# Altium project DisplayBrd.PrjPCB
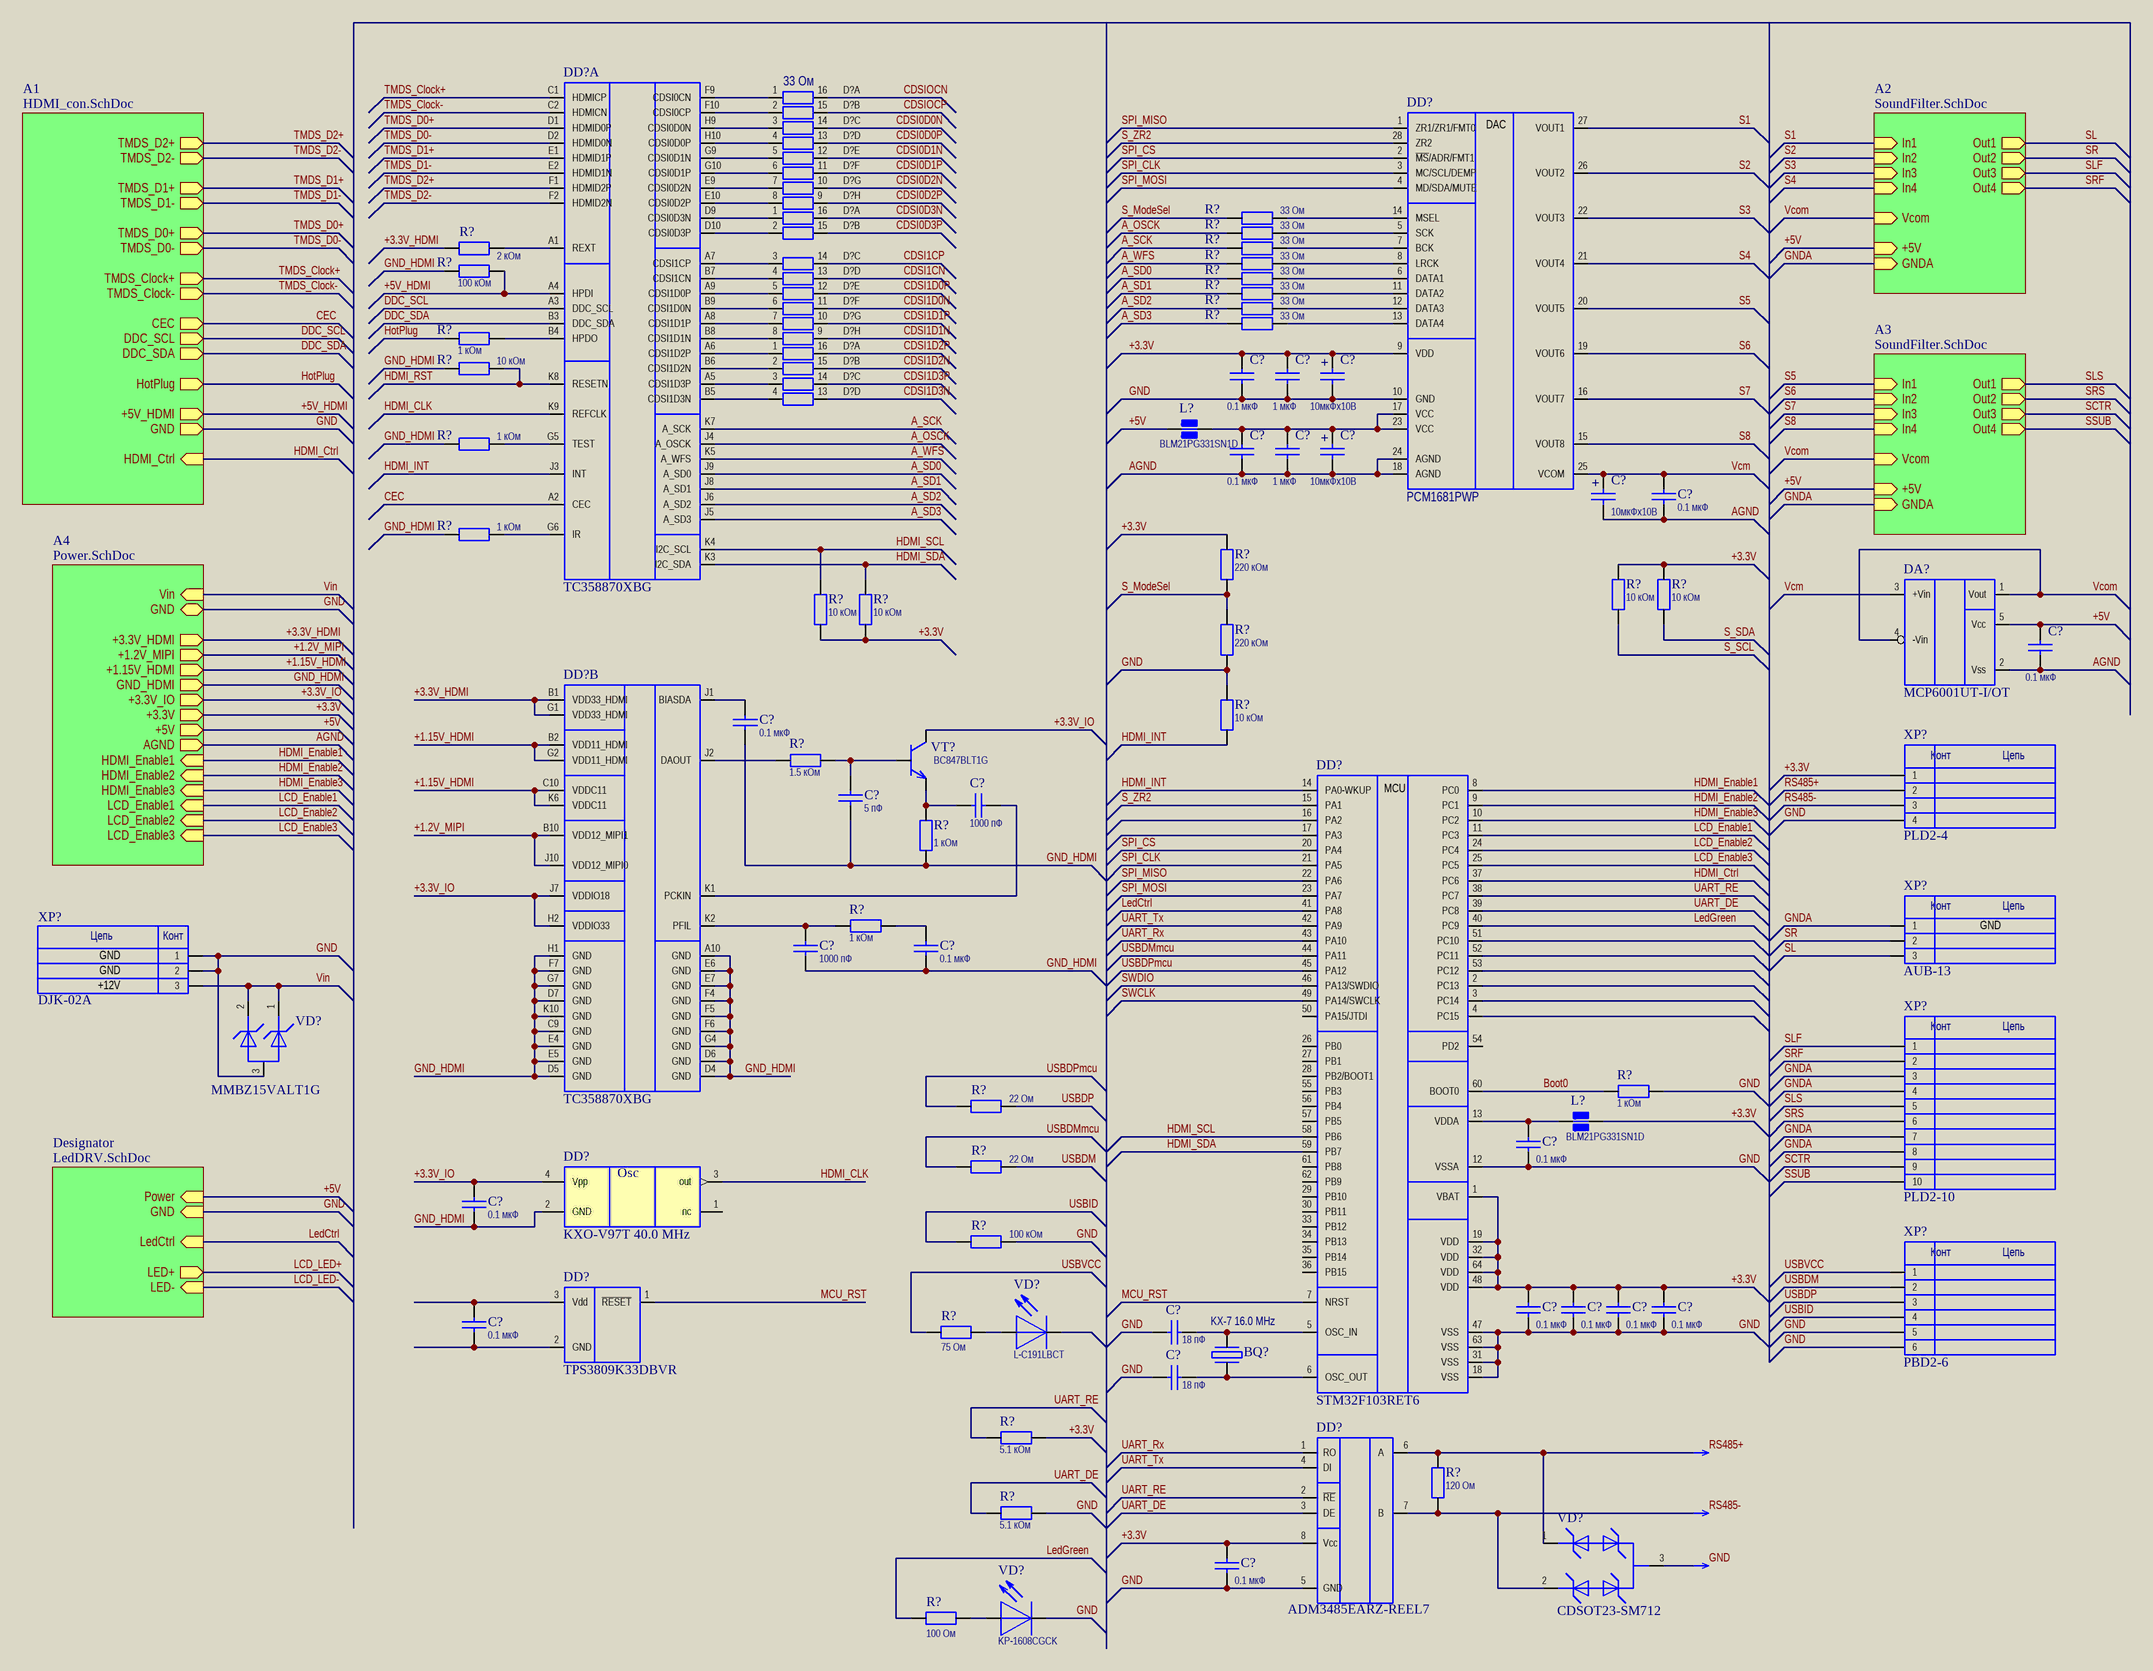
[diagram p0: Top.SchDoc]
6 sheets, 302 parts. Net scope: hierarchical (ports join the sheet entries above them; power ports are global).
Sheets:
  Top.SchDoc
    A2 = SoundFilter.SchDoc
    A3 = SoundFilter.SchDoc
    A1 = HDMI_con.SchDoc
    A4 = Power.SchDoc
    Designator = LedDRV.SchDoc
  LCD_Connector.SchDoc

## Sheet Top.SchDoc
size 437 x 311 mm

### Parts
(Parts that share a designator on the sheet are numbered #1, #2 ... from top to bottom, then left to right.)
BQ?  KX-7 16.0 MHz  [KX-7]
C?#1  value 0.1 мкФ  [Chip0603]  (hidden comment: C)
C?#2  value 1 мкФ  [Chip0603]  (hidden comment: C)
C?#3  value 10мкФx10В  [ChipA]  (hidden comment: CP)
C?#4  value 0.1 мкФ  [Chip0603]  (hidden comment: C)
C?#5  value 1 мкФ  [Chip0603]  (hidden comment: C)
C?#6  value 10мкФx10В  [ChipA]  (hidden comment: CP)
C?#7  value 10мкФx10В  [ChipA]  (hidden comment: CP)
C?#8  value 0.1 мкФ  [Chip0603]  (hidden comment: C)
C?#9  value 0.1 мкФ  [Chip0603]  (hidden comment: C)
C?#10  value 0.1 мкФ  [Chip0603]  (hidden comment: C)
C?#11  value 5 пФ  [Chip0603]  (hidden comment: C)
C?#12  value 1000 пФ  [Chip0603]  (hidden comment: C)
C?#13  value 0.1 мкФ  [Chip0603]  (hidden comment: C)
C?#14  value 1000 пФ  [Chip0603]  (hidden comment: C)
C?#15  value 0.1 мкФ  [Chip0603]  (hidden comment: C)
C?#16  value 0.1 мкФ  [Chip0603]  (hidden comment: C)
C?#17  value 0.1 мкФ  [Chip0603]  (hidden comment: C)
C?#18  value 0.1 мкФ  [Chip0603]  (hidden comment: C)
C?#19  value 0.1 мкФ  [Chip0603]  (hidden comment: C)
C?#20  value 0.1 мкФ  [Chip0603]  (hidden comment: C)
C?#21  value 0.1 мкФ  [Chip0603]  (hidden comment: C)
C?#22  value 18 пФ  [Chip0603]  (hidden comment: C)
C?#23  value 18 пФ  [Chip0603]  (hidden comment: C)
C?#24  value 0.1 мкФ  [Chip0603]  (hidden comment: C)
D?#1  value 33 Ом  [YC248]  (hidden comment: YC248-JR-0733RL)  (part A of 8)
D?#2  YC248-JR-0733RL  [YC248]  (value not drawn)  (part B of 8)
D?#3  YC248-JR-0733RL  [YC248]  (value not drawn)  (part C of 8)
D?#4  YC248-JR-0733RL  [YC248]  (value not drawn)  (part D of 8)
D?#5  YC248-JR-0733RL  [YC248]  (value not drawn)  (part E of 8)
D?#6  YC248-JR-0733RL  [YC248]  (value not drawn)  (part F of 8)
D?#7  YC248-JR-0733RL  [YC248]  (value not drawn)  (part G of 8)
D?#8  YC248-JR-0733RL  [YC248]  (value not drawn)  (part H of 8)
D?#9  YC248-JR-0733RL  [YC248]  (value not drawn)  (part A of 8)
D?#10  YC248-JR-0733RL  [YC248]  (value not drawn)  (part B of 8)
D?#11  YC248-JR-0733RL  [YC248]  (value not drawn)  (part C of 8)
D?#12  YC248-JR-0733RL  [YC248]  (value not drawn)  (part D of 8)
D?#13  YC248-JR-0733RL  [YC248]  (value not drawn)  (part E of 8)
D?#14  YC248-JR-0733RL  [YC248]  (value not drawn)  (part F of 8)
D?#15  YC248-JR-0733RL  [YC248]  (value not drawn)  (part G of 8)
D?#16  YC248-JR-0733RL  [YC248]  (value not drawn)  (part H of 8)
D?#17  YC248-JR-0733RL  [YC248]  (value not drawn)  (part A of 8)
D?#18  YC248-JR-0733RL  [YC248]  (value not drawn)  (part B of 8)
D?#19  YC248-JR-0733RL  [YC248]  (value not drawn)  (part C of 8)
D?#20  YC248-JR-0733RL  [YC248]  (value not drawn)  (part D of 8)
DA?#1  MCP6001UT-I/OT  [SOT23-5]
DD?#1  PCM1681PWP  [HTSSOP-28]
DD?#2  TC358870XBG  [BGA80C65P10X10_700X700X100]  (part A of 2)
DD?#3  STM32F103RET6  [LQFP64_N]
DD?#4  TC358870XBG  [BGA80C65P10X10_700X700X100]  (part B of 2)
DD?#5  KXO-V97T 40.0 MHz  [KXO-V97T]
DD?#6  TPS3809K33DBVR  [SOT23]
DD?#7  ADM3485EARZ-REEL7  [SO8_s]
L?#1  Name: BLM21PG331SN1D  [Chip0805]  (hidden comment: Bead)
L?#2  Name: BLM21PG331SN1D  [Chip0805]  (hidden comment: Bead)
R?#1  33 Ом  [Res0603]
R?#2  33 Ом  [Res0603]
R?#3  2 кОм  [Res0603]
R?#4  33 Ом  [Res0603]
R?#5  33 Ом  [Res0603]
R?#6  100 кОм  [Res0603]
R?#7  33 Ом  [Res0603]
R?#8  33 Ом  [Res0603]
R?#9  33 Ом  [Res0603]
R?#10  33 Ом  [Res0603]
R?#11  1 кОм  [Res0603]
R?#12  10 кОм  [Res0603]
R?#13  1 кОм  [Res0603]
R?#14  1 кОм  [Res0603]
R?#15  220 кОм  [Res0603]
R?#16  10 кОм  [Res0603]
R?#17  10 кОм  [Res0603]
R?#18  10 кОм  [Res0603]
R?#19  10 кОм  [Res0603]
R?#20  220 кОм  [Res0603]
R?#21  10 кОм  [Res0603]
R?#22  1.5 кОм  [Res0603]
R?#23  1 кОм  [Res0603]
R?#24  1 кОм  [Res0603]
R?#25  1 кОм  [Res0603]
R?#26  22 Ом  [Res0603]
R?#27  22 Ом  [Res0603]
R?#28  100 кОм  [Res0603]
R?#29  75 Ом  [Res0603]
R?#30  5.1 кОм  [Res0603]
R?#31  120 Ом  [Res0603]
R?#32  5.1 кОм  [Res0603]
R?#33  100 Ом  [Res0603]
VD?#1  MMBZ15VALT1G  [SOT23]
VD?#2  L-C191LBCT  [LED_ltst_blue]
VD?#3  CDSOT23-SM712  [SOT23]
VD?#4  KP-1608CGCK  [LED_ltst_green]
VT?#1  Name: BC847BLT1G  [SOT23]  (hidden comment: NPN)
XP?#1  AUB-13  [AUB-13]
XP?#2  DJK-02A  [DJK-02A]
XP?#3  CON_4  [PLD2-4]  (value not drawn)
XP?#4  PLD2-10  [PLD2-10]
XP?#5  Name: PBD2-6  [USB-MINI]  (hidden comment: CON_6)

### Sub-sheets
A1 = HDMI_con.SchDoc: TMDS_D2+ (out), TMDS_D2- (out), TMDS_D1+ (out), TMDS_D1- (out), TMDS_D0+ (out), TMDS_D0- (out), TMDS_Clock+ (out), TMDS_Clock- (out), CEC (out), DDC_SCL (out), DDC_SDA (out), HotPlug (out), +5V_HDMI (out), GND (out), HDMI_Ctrl (in)
A2 = SoundFilter.SchDoc: In1 (in), In2 (in), In3 (in), In4 (in), Vcom (in), +5V (in), GNDA (in), Out1 (out), Out2 (out), Out3 (out), Out4 (out)
A3 = SoundFilter.SchDoc: In1 (in), In2 (in), In3 (in), In4 (in), Vcom (in), +5V (in), GNDA (in), Out1 (out), Out2 (out), Out3 (out), Out4 (out)
A4 = Power.SchDoc: Vin (in), GND (bidir), +3.3V_HDMI (out), +1.2V_MIPI (out), +1.15V_HDMI (out), GND_HDMI (out), +3.3V_IO (out), +3.3V (out), +5V (out), HDMI_Enable1 (in), HDMI_Enable2 (in), HDMI_Enable3 (in), LCD_Enable1 (in), LCD_Enable2 (in), LCD_Enable3 (in), AGND (out)
Designator = LedDRV.SchDoc: Power (in), GND (in), LedCtrl (in), LED+ (out), LED- (in)

### Nets
+3.3V: C?#1.1 C?#2.1 C?#3.1 C?#17.1 C?#18.1 C?#19.1 C?#20.1 C?#24.1 DD?#1.9(VDD) DD?#3.1(VBAT) DD?#3.19(VDD) DD?#3.32(VDD) DD?#3.48(VDD) DD?#3.64(VDD) DD?#7.8(Vcc) L?#2.2 R?#15.2 R?#16.2 R?#17.2 R?#18.1 R?#19.1 R?#30.2 XP?#3.1 ; sheet A4/+3.3V
+5V: C?#9.1 DA?#1.5(Vcc) L?#1.1 ; sheet A2/+5V, sheet A3/+5V, sheet A4/+5V, sheet Designator/Power
GND: BQ?.2 BQ?.4 C?#1.2 C?#2.2 C?#3.2 C?#15.2 C?#17.2 C?#18.2 C?#19.2 C?#20.2 C?#22.1 C?#23.1 C?#24.2 DD?#1.10(GND) DD?#3.12(VSSA) DD?#3.18(VSS) DD?#3.31(VSS) DD?#3.47(VSS) DD?#3.63(VSS) DD?#7.5(GND) R?#20.1 R?#21.1 R?#25.1 R?#28.2 R?#32.1 VD?#1.3 VD?#3.3 VD?#4.2 XP?#2.1 XP?#2.2 XP?#3.4 XP?#5.5 XP?#5.6 ; sheet A1/GND, sheet A4/GND, sheet Designator/GND
GNDA: XP?#1.1 XP?#4.3 XP?#4.4 XP?#4.7 XP?#4.8 ; sheet A2/GNDA, sheet A3/GNDA
+1.2V_MIPI: DD?#4.B10(VDD12_MIPI1) DD?#4.J10(VDD12_MIPI0) ; sheet A4/+1.2V_MIPI
+1.15V_HDMI: DD?#4.B2(VDD11_HDMI) DD?#4.C10(VDDC11) DD?#4.G2(VDD11_HDMI) DD?#4.K6(VDDC11) ; sheet A4/+1.15V_HDMI
+3.3V_HDMI: DD?#4.B1(VDD33_HDMI) DD?#4.G1(VDD33_HDMI) R?#3.2 ; sheet A4/+3.3V_HDMI
+3.3V_IO: C?#16.1 DD?#4.H2(VDDIO33) DD?#4.J7(VDDIO18) DD?#5.4(Vpp) VT?#1.3 ; sheet A4/+3.3V_IO
+5V_HDMI: DD?#2.A4(HPDI) R?#6.1 ; sheet A1/+5V_HDMI
A_OSCK: DD?#2.J4(A_OSCK) R?#2.1
A_SCK: DD?#2.K7(A_SCK) R?#4.1
A_SD0: DD?#2.J9(A_SD0) R?#7.1
A_SD1: DD?#2.J8(A_SD1) R?#8.1
A_SD2: DD?#2.J6(A_SD2) R?#9.1
A_SD3: DD?#2.J5(A_SD3) R?#10.1
A_WFS: DD?#2.K5(A_WFS) R?#5.1
AGND: C?#4.2 C?#5.2 C?#6.2 C?#7.2 C?#8.2 C?#9.2 DA?#1.2(Vss) DD?#1.18(AGND) DD?#1.24(AGND) ; sheet A4/AGND
Boot0: DD?#3.60(BOOT0) R?#25.2
CDSI0D0N: D?#3.14(B2)
CDSI0D0P: D?#4.13(B3)
CDSI0D1N: D?#5.12(B4)
CDSI0D1P: D?#6.11(B5)
CDSI0D2N: D?#7.10(B6)
CDSI0D2P: D?#8.9(B7)
CDSI0D3N: D?#9.16(B0)
CDSI0D3P: D?#10.15(B1)
CDSI1CN: D?#12.13(B3)
CDSI1CP: D?#11.14(B2)
CDSI1D0N: D?#14.11(B5)
CDSI1D0P: D?#13.12(B4)
CDSI1D1N: D?#16.9(B7)
CDSI1D1P: D?#15.10(B6)
CDSI1D2N: D?#18.15(B1)
CDSI1D2P: D?#17.16(B0)
CDSI1D3N: D?#20.13(B3)
CDSI1D3P: D?#19.14(B2)
CDSIOCN: D?#1.16(B0)
CDSIOCP: D?#2.15(B1)
CEC: DD?#2.A2(CEC) ; sheet A1/CEC
DDC_SCL: DD?#2.A3(DDC_SCL) ; sheet A1/DDC_SCL
DDC_SDA: DD?#2.B3(DDC_SDA) ; sheet A1/DDC_SDA
GND_HDMI: C?#10.2 C?#11.1 C?#13.2 C?#14.1 C?#16.2 DD?#4.A10(GND) DD?#4.C9(GND) DD?#4.D4(GND) DD?#4.D5(GND) DD?#4.D6(GND) DD?#4.D7(GND) DD?#4.E4(GND) DD?#4.E5(GND) DD?#4.E6(GND) DD?#4.E7(GND) DD?#4.F4(GND) DD?#4.F5(GND) DD?#4.F6(GND) DD?#4.F7(GND) DD?#4.G4(GND) DD?#4.G7(GND) DD?#4.H1(GND) DD?#4.K10(GND) DD?#5.2(GND) R?#6.2 R?#12.2 R?#13.2 R?#14.2 R?#23.1 ; sheet A4/GND_HDMI
HDMI_CLK: DD?#2.K9(REFCLK) DD?#5.3(out)
HDMI_Ctrl: DD?#3.37(PC6) ; sheet A1/HDMI_Ctrl
HDMI_Enable1: DD?#3.8(PC0) ; sheet A4/HDMI_Enable1
HDMI_Enable2: DD?#3.9(PC1) ; sheet A4/HDMI_Enable2
HDMI_Enable3: DD?#3.10(PC2) ; sheet A4/HDMI_Enable3
HDMI_INT: DD?#2.J3(INT) DD?#3.14(PA0-WKUP) R?#21.2
HDMI_RST: DD?#2.K8(RESETN) R?#12.1
HDMI_SCL: DD?#2.K4(I2C_SCL) DD?#3.58(PB6) R?#18.2
HDMI_SDA: DD?#2.K3(I2C_SDA) DD?#3.59(PB7) R?#19.2
HotPlug: R?#11.2 ; sheet A1/HotPlug
LCD_Enable1: DD?#3.11(PC3) ; sheet A4/LCD_Enable1
LCD_Enable2: DD?#3.24(PC4) ; sheet A4/LCD_Enable2
LCD_Enable3: DD?#3.25(PC5) ; sheet A4/LCD_Enable3
LedCtrl: DD?#3.41(PA8) ; sheet Designator/LedCtrl
LedGreen: DD?#3.40(PC9) R?#33.1
MCU_RST: DD?#3.7(NRST) DD?#6.1(~{RESET})
RS485+: DD?#7.6(A) R?#31.1 VD?#3.1 XP?#3.2
RS485-: DD?#7.7(B) R?#31.2 VD?#3.2 XP?#3.3
S1: DD?#1.27(VOUT1) ; sheet A2/In1  [project net In1]
S2: DD?#1.26(VOUT2) ; sheet A2/In2  [project net In2]
S3: DD?#1.22(VOUT3) ; sheet A2/In3  [project net In3]
S4: DD?#1.21(VOUT4) ; sheet A2/In4  [project net In4]
S5: DD?#1.20(VOUT5) ; sheet A3/In1  [project net In1]
S6: DD?#1.19(VOUT6) ; sheet A3/In2  [project net In2]
S7: DD?#1.16(VOUT7) ; sheet A3/In3  [project net In3]
S8: DD?#1.15(VOUT8) ; sheet A3/In4  [project net In4]
S_ModeSel: R?#1.1 R?#15.1 R?#20.2
S_SCL: R?#16.1
S_SDA: R?#17.1
S_ZR2: DD?#1.28(ZR2) DD?#3.15(PA1)
SCTR: XP?#4.9 ; sheet A3/Out3  [project net Out3]
SL: XP?#1.3 ; sheet A2/Out1  [project net Out1]
SLF: XP?#4.1 ; sheet A2/Out3  [project net Out3]
SLS: XP?#4.5 ; sheet A3/Out1  [project net Out1]
SPI_CLK: DD?#1.3(MC/SCL/DEMP) DD?#3.21(PA5)
SPI_CS: DD?#1.2(~{MS}/ADR/FMT1) DD?#3.20(PA4)
SPI_MISO: DD?#1.1(ZR1/ZR1/FMT0) DD?#3.22(PA6)
SPI_MOSI: DD?#1.4(MD/SDA/MUTE) DD?#3.23(PA7)
SR: XP?#1.2 ; sheet A2/Out2  [project net Out2]
SRF: XP?#4.2 ; sheet A2/Out4  [project net Out4]
SRS: XP?#4.6 ; sheet A3/Out2  [project net Out2]
SSUB: XP?#4.10 ; sheet A3/Out4  [project net Out4]
SWCLK: DD?#3.49(PA14/SWCLK)
SWDIO: DD?#3.46(PA13/SWDIO)
TMDS_Clock+: DD?#2.C1(HDMICP) ; sheet A1/TMDS_Clock+
TMDS_Clock-: DD?#2.C2(HDMICN) ; sheet A1/TMDS_Clock-
TMDS_D0+: DD?#2.D1(HDMID0P) ; sheet A1/TMDS_D0+
TMDS_D0-: DD?#2.D2(HDMID0N) ; sheet A1/TMDS_D0-
TMDS_D1+: DD?#2.E1(HDMID1P) ; sheet A1/TMDS_D1+
TMDS_D1-: DD?#2.E2(HDMID1N) ; sheet A1/TMDS_D1-
TMDS_D2+: DD?#2.F1(HDMID2P) ; sheet A1/TMDS_D2+
TMDS_D2-: DD?#2.F2(HDMID2N) ; sheet A1/TMDS_D2-
UART_DE: DD?#3.39(PC8) DD?#7.3(DE) R?#32.2
UART_RE: DD?#3.38(PC7) DD?#7.2(~{RE}) R?#30.1
UART_Rx: DD?#3.43(PA10) DD?#7.1(RO)
UART_Tx: DD?#3.42(PA9) DD?#7.4(DI)
USBDM: R?#27.2 XP?#5.2
USBDMmcu: DD?#3.44(PA11) R?#27.1
USBDP: R?#26.2 XP?#5.3
USBDPmcu: DD?#3.45(PA12) R?#26.1
USBID: R?#28.1 XP?#5.4
USBVCC: R?#29.1 XP?#5.1
Vcm: C?#7.1 C?#8.1 DA?#1.3(+Vin) DD?#1.25(VCOM)
Vcom: DA?#1.1(Vout) DA?#1.4(-Vin) ; sheet A2/Vcom, sheet A3/Vcom
Vin: VD?#1.1 VD?#1.2 XP?#2.3 ; sheet A4/Vin
NetBQ?_1: BQ?.1 C?#23.2 DD?#3.6(OSC_OUT)
NetBQ?_3: BQ?.3 C?#22.2 DD?#3.5(OSC_IN)
NetC?#4_1: C?#4.1 C?#5.1 C?#6.1 DD?#1.17(VCC) DD?#1.23(VCC) L?#1.2
NetC?#10_1: C?#10.1 DD?#4.J1(BIASDA)
NetC?#11_2: C?#11.2 R?#22.1 VT?#1.2
NetC?#12_1: C?#12.1 R?#23.2 VT?#1.1
NetC?#12_2: C?#12.2 DD?#4.K1(PCKIN)
NetC?#13_1: C?#13.1 R?#24.1
NetC?#14_2: C?#14.2 DD?#4.K2(PFIL) R?#24.2
NetC?#15_1: C?#15.1 DD?#3.13(VDDA) L?#2.1
NetC?#21_1: C?#21.1 DD?#6.3(Vdd)
NetC?#21_2: C?#21.2 DD?#6.2(GND)
NetD?#1_1: D?#1.1(A0) DD?#2.F9(CDSI0CN)
NetD?#2_2: D?#2.2(A1) DD?#2.F10(CDSI0CP)
NetD?#3_3: D?#3.3(A2) DD?#2.H9(CDSI0D0N)
NetD?#4_4: D?#4.4(A3) DD?#2.H10(CDSI0D0P)
NetD?#5_5: D?#5.5(A4) DD?#2.G9(CDSI0D1N)
NetD?#6_6: D?#6.6(A5) DD?#2.G10(CDSI0D1P)
NetD?#7_7: D?#7.7(A6) DD?#2.E9(CDSI0D2N)
NetD?#8_8: D?#8.8(A7) DD?#2.E10(CDSI0D2P)
NetD?#9_1: D?#9.1(A0) DD?#2.D9(CDSI0D3N)
NetD?#10_2: D?#10.2(A1) DD?#2.D10(CDSI0D3P)
NetD?#11_3: D?#11.3(A2) DD?#2.A7(CDSI1CP)
NetD?#12_4: D?#12.4(A3) DD?#2.B7(CDSI1CN)
NetD?#13_5: D?#13.5(A4) DD?#2.A9(CDSI1D0P)
NetD?#14_6: D?#14.6(A5) DD?#2.B9(CDSI1D0N)
NetD?#15_7: D?#15.7(A6) DD?#2.A8(CDSI1D1P)
NetD?#16_8: D?#16.8(A7) DD?#2.B8(CDSI1D1N)
NetD?#17_1: D?#17.1(A0) DD?#2.A6(CDSI1D2P)
NetD?#18_2: D?#18.2(A1) DD?#2.B6(CDSI1D2N)
NetD?#19_3: D?#19.3(A2) DD?#2.A5(CDSI1D3P)
NetD?#20_4: D?#20.4(A3) DD?#2.B5(CDSI1D3N)
NetDD?#1_5: DD?#1.5(SCK) R?#2.2
NetDD?#1_6: DD?#1.6(DATA1) R?#7.2
NetDD?#1_7: DD?#1.7(BCK) R?#4.2
NetDD?#1_8: DD?#1.8(LRCK) R?#5.2
NetDD?#1_11: DD?#1.11(DATA2) R?#8.2
NetDD?#1_12: DD?#1.12(DATA3) R?#9.2
NetDD?#1_13: DD?#1.13(DATA4) R?#10.2
NetDD?#1_14: DD?#1.14(MSEL) R?#1.2
NetDD?#2_A1: DD?#2.A1(REXT) R?#3.1
NetDD?#2_B4: DD?#2.B4(HPDO) R?#11.1
NetDD?#2_G5: DD?#2.G5(TEST) R?#13.1
NetDD?#2_G6: DD?#2.G6(IR) R?#14.1
NetDD?#4_J2: DD?#4.J2(DAOUT) R?#22.2
NetR?#29_2: R?#29.2 VD?#2.1
NetR?#33_2: R?#33.2 VD?#4.1

Not connected (* = marked no-connect by the designer): DD?#3 2(PC13) 3(PC14) 4(PC15) 16(PA2) 17(PA3) 26(PB0) 27(PB1) 28(PB2/BOOT1) 29(PB10) 30(PB11) 33(PB12) 34(PB13) 35(PB14) 36(PB15) 50(PA15/JTDI) 51(PC10) 52(PC11) 53(PC12) 54(PD2) 55(PB3) 56(PB4) 57(PB5) 61(PB8) 62(PB9); DD?#5 1(nc); VD?#2 2

### Notes on the sheet
- GND
- +12V
- Перв. примен.
- М. экспертиза
- Справ. №
- Подп. и дата
- Инв. № дубл.
- Взам. инв. №
- Изм.
- Разраб.
- Лист.
- № докум.
- Подп.
- Дата
- Лит.
- Масса
- Масш.
- Инв. № подп.
- Пров.
- Т. контр.
- Н. контр.
- Утв.
- Схема электрическая
- принципиальная
- Лист
- Листов
- Копировал
- Формат А1
- (in symbol CON_3) Цепь; Конт
- (in symbol CON_4) Конт; Цепь
- (in symbol CON_6) Конт; Цепь
- (in symbol CON_10) Конт; Цепь
- (in symbol CP) +
- (in symbol GXO7531) Osc
- (in symbol PCM1681PWPR) DAC
- (in symbol STM32F103RxT6) MCU

### Library data of the parts
BQ? = Crystal: Manufacturer: Any; Class: Resonators; Value: 8 MHz; SubClass: Crystal; Name: KX-7 16.0 MHz; Author: Harry E. Zhurov; FullName: =(Name)
C?#1 C?#2 C?#4 C?#5 C?#8-C?#21 C?#24 = C: Manufacturer: Any; SubClass: General Purpose; Class: Capacitors; Author: Harry E. Zhurov
C?#3 C?#6 C?#7 = CP: Manufacturer: Any; Class: Capacitors; SubClass: Polar; Name: TPSA106K010R0900; Author: Harry E. Zhurov
C?#22 C?#23 = C: Manufacturer: Any; SubClass: General Purpose; Class: Capacitors; Name: CL10C180JB8NNNC; Author: Harry E. Zhurov
D?#1-D?#8 = ResArray8_2: Резисторная сборка; AnnotateMatch: 1; Name: YC248-JR-0733RL
D?#9-D?#16 = ResArray8_2: Резисторная сборка; AnnotateMatch: 2; Name: YC248-JR-0733RL
D?#17-D?#20 = ResArray8_2: Резисторная сборка; AnnotateMatch: 3; Name: YC248-JR-0733RL
DD?#1 = PCM1681PWPR: Name: PCM1681PWP
DD?#2 DD?#4 = TC358870XBG: Interface Bridges (Mobile Peripheral Devices); Name: TC358870XBG
DD?#3 = STM32F103RxT6: Name: STM32F103RET6
DD?#5 = GXO7531: 3.3V CMOS Oscillator; Name: KXO-V97T 40.0 MHz
DD?#6 = TPS3809K33DBVR: 3-Pin Supply Voltage Supervisors; Name: TPS3809K33DBVR
DD?#7 = ADM3485EARZ-REEL7: 3.3 V Slew Rate Limited, Half-Duplex, RS-485/RS-422 Transceivers; Name: ADM3485EARZ-REEL7
L?#1 L?#2 = Bead: Manufacturer: Any; SubClass: General Purpose; Class: Capacitors; Author: Harry E. Zhurov
R?#1-R?#33 = R: Manufacturer: Any; Class: Resistor; SubClass: Constant
  R?#1 R?#2 R?#4 R?#5 R?#7-R?#10: Value: 33 Ом
  R?#3: Value: 2 кОм
  R?#6 R?#28: Value: 100 кОм
  R?#11 R?#13 R?#14 R?#23-R?#25: Value: 1 кОм
  R?#12 R?#16-R?#19 R?#21: Value: 10 кОм
  R?#15 R?#20: Value: 220 кОм
  R?#22: Value: 1.5 кОм
  R?#26 R?#27: Value: 22 Ом
  R?#29: Value: 75 Ом
  R?#30 R?#32: Value: 5.1 кОм
  R?#31: Value: 120 Ом
  R?#33: Value: 100 Ом
VD?#1 = Dual supressor: Name: MMBZ15VALT1G
VD?#2 VD?#4 = LD: Manufacturer: Any; Class: LED; Author: Harry E. Zhurov
  VD?#2: Name: L-C191LBCT
  VD?#4: Name: KP-1608CGCK
VD?#3 = CDSOT23-SM712: Surface Mount TVS Diode; Name: CDSOT23-SM712
VT?#1 = NPN: Manufacturer: Any; Class: Transistors; SubClass: NPN; Author: Harry E. Zhurov; FullName: =(Name)
XP?#1 XP?#2 = CON_3
  XP?#1: Name: AUB-13
  XP?#2: Name: DJK-02A
XP?#4 = CON_10: Name: PLD2-10
DA?#1 = MCP6001UT-I/OT: Name: MCP6001UT-I/OT
XP?#3 = CON_4: Name: PLD2-4

## Sheet SoundFilter.SchDoc
size 311 x 223 mm
Used 2 times, as channels A2, A3. Parts and nets are listed once, with the designators drawn on the sheet.
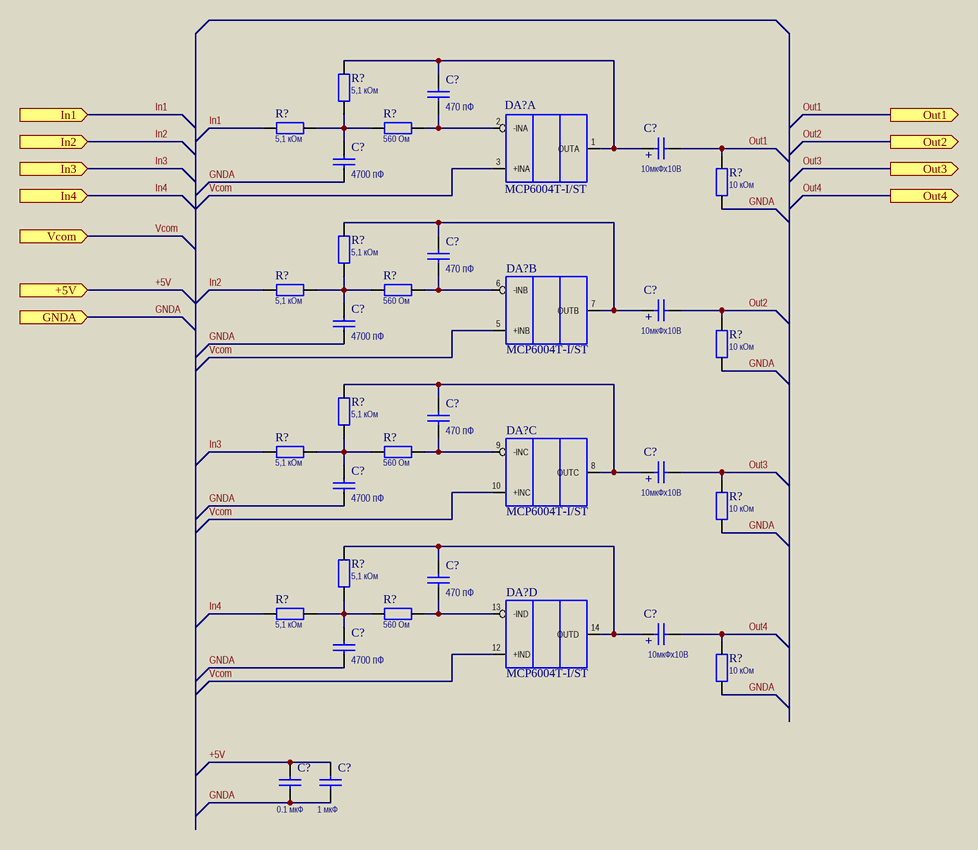
[diagram p1: SoundFilter.SchDoc]

### Parts
(Parts that share a designator on the sheet are numbered #1, #2 ... from top to bottom, then left to right.)
C?#1  470 пФ  [Chip0603]
C?#2  4700 пФ  [Chip0603]
C?#3  value 10мкФx10В  [ChipA]  (hidden comment: CP)
C?#4  470 пФ  [Chip0603]
C?#5  4700 пФ  [Chip0603]
C?#6  value 10мкФx10В  [ChipA]  (hidden comment: CP)
C?#7  470 пФ  [Chip0603]
C?#8  4700 пФ  [Chip0603]
C?#9  value 10мкФx10В  [ChipA]  (hidden comment: CP)
C?#10  470 пФ  [Chip0603]
C?#11  4700 пФ  [Chip0603]
C?#12  value 10мкФx10В  [ChipA]  (hidden comment: CP)
C?#13  value 0.1 мкФ  [Chip0603]  (hidden comment: C)
C?#14  value 1 мкФ  [Chip0603]  (hidden comment: C)
DA?#1  MCP6004T-I/ST  [TSSOP14]  (part A of 4)
DA?#2  MCP6004T-I/ST  [TSSOP14]  (part B of 4)
DA?#3  MCP6004T-I/ST  [TSSOP14]  (part C of 4)
DA?#4  MCP6004T-I/ST  [TSSOP14]  (part D of 4)
R?#1  5,1 кОм  [Res0603]
R?#2  5,1 кОм  [Res0603]
R?#3  560 Ом  [Res0603]
R?#4  10 кОм  [Res0603]
R?#5  5,1 кОм  [Res0603]
R?#6  5,1 кОм  [Res0603]
R?#7  560 Ом  [Res0603]
R?#8  10 кОм  [Res0603]
R?#9  5,1 кОм  [Res0603]
R?#10  5,1 кОм  [Res0603]
R?#11  560 Ом  [Res0603]
R?#12  10 кОм  [Res0603]
R?#13  5,1 кОм  [Res0603]
R?#14  5,1 кОм  [Res0603]
R?#15  560 Ом  [Res0603]
R?#16  10 кОм  [Res0603]

### Ports
+5V (in), GNDA (in), In1 (in), In2 (in), In3 (in), In4 (in), Out1 (out), Out2 (out), Out3 (out), Out4 (out), Vcom (in)

### Nets
+5V: C?#13.1 C?#14.1 DA?#1.4(Vcc) ; port +5V
GNDA: C?#2.2 C?#5.2 C?#8.2 C?#11.2 C?#13.2 C?#14.2 DA?#1.11(Vss) R?#4.2 R?#8.2 R?#12.2 R?#16.2 ; port GNDA
In1: R?#2.2 ; port In1
In2: R?#6.2 ; port In2
In3: R?#10.2 ; port In3
In4: R?#14.2 ; port In4
Out1: C?#3.2 R?#4.1 ; port Out1
Out2: C?#6.2 R?#8.1 ; port Out2
Out3: C?#9.2 R?#12.1 ; port Out3
Out4: C?#12.2 R?#16.1 ; port Out4
Vcom: DA?#1.3(+INA) DA?#2.5(+INB) DA?#3.10(+INC) DA?#4.12(+IND) ; port Vcom
NetC?#1_1: C?#1.1 C?#3.1 DA?#1.1(OUTA) R?#1.1
NetC?#1_2: C?#1.2 DA?#1.2(-INA) R?#3.1
NetC?#2_1: C?#2.1 R?#1.2 R?#2.1 R?#3.2
NetC?#4_1: C?#4.1 C?#6.1 DA?#2.7(OUTB) R?#5.1
NetC?#4_2: C?#4.2 DA?#2.6(-INB) R?#7.1
NetC?#5_1: C?#5.1 R?#5.2 R?#6.1 R?#7.2
NetC?#7_1: C?#7.1 C?#9.1 DA?#3.8(OUTC) R?#9.1
NetC?#7_2: C?#7.2 DA?#3.9(-INC) R?#11.1
NetC?#8_1: C?#8.1 R?#9.2 R?#10.1 R?#11.2
NetC?#10_1: C?#10.1 C?#12.1 DA?#4.14(OUTD) R?#13.1
NetC?#10_2: C?#10.2 DA?#4.13(-IND) R?#15.1
NetC?#11_1: C?#11.1 R?#13.2 R?#14.1 R?#15.2

### Channels
A2: designators C?=C?_A2#3 C?=C?_A2#2 C?=C?_A2#1 C?=C?_A2#6 C?=C?_A2#5 C?=C?_A2#4 C?=C?_A2#9 C?=C?_A2#8 C?=C?_A2#7 C?=C?_A2#12 C?=C?_A2#11 C?=C?_A2#10 C?=C?_A2#14 C?=C?_A2#13 DA?=DA?_A2#1 DA?=DA?_A2#2 DA?=DA?_A2#3 DA?=DA?_A2#4 R?=R?_A2#2 R?=R?_A2#3 R?=R?_A2#1 R?=R?_A2#4 R?=R?_A2#6 R?=R?_A2#7 R?=R?_A2#5 R?=R?_A2#8 R?=R?_A2#10 R?=R?_A2#11 R?=R?_A2#9 R?=R?_A2#12 R?=R?_A2#14 R?=R?_A2#15 R?=R?_A2#13 R?=R?_A2#16; ports +5V=+5V GNDA=GNDA In1=In1 In2=In2 In3=In3 In4=In4 Out1=Out1 Out2=Out2 Out3=Out3 Out4=Out4 Vcom=Vcom
A3: designators C?=C?_A3#3 C?=C?_A3#2 C?=C?_A3#1 C?=C?_A3#6 C?=C?_A3#5 C?=C?_A3#4 C?=C?_A3#9 C?=C?_A3#8 C?=C?_A3#7 C?=C?_A3#12 C?=C?_A3#11 C?=C?_A3#10 C?=C?_A3#14 C?=C?_A3#13 DA?=DA?_A3#1 DA?=DA?_A3#2 DA?=DA?_A3#3 DA?=DA?_A3#4 R?=R?_A3#2 R?=R?_A3#3 R?=R?_A3#1 R?=R?_A3#4 R?=R?_A3#6 R?=R?_A3#7 R?=R?_A3#5 R?=R?_A3#8 R?=R?_A3#10 R?=R?_A3#11 R?=R?_A3#9 R?=R?_A3#12 R?=R?_A3#14 R?=R?_A3#15 R?=R?_A3#13 R?=R?_A3#16; ports +5V=+5V GNDA=GNDA In1=In1 In2=In2 In3=In3 In4=In4 Out1=Out1 Out2=Out2 Out3=Out3 Out4=Out4 Vcom=Vcom

### Notes on the sheet
- Перв. примен.
- М. экспертиза
- Справ. №
- Подп. и дата
- Инв. № дубл.
- Взам. инв. №
- Изм.
- Разраб.
- Лист.
- № докум.
- Подп.
- Дата
- Лит.
- Масса
- Масш.
- Инв. № подп.
- Пров.
- Т. контр.
- Н. контр.
- Утв.
- Схема электрическая
- принципиальная
- Лист
- Листов
- Копировал
- Формат А2
- (in symbol CP) +

### Library data of the parts
C?#1 C?#2 C?#4 C?#5 C?#7 C?#8 C?#10 C?#11 C?#13 C?#14 = C: as C?#1 on sheet Top; Author: Harry E. Zhurov
  C?#1 C?#4 C?#7 C?#10: Value: 470 пФ
  C?#2 C?#5 C?#8 C?#11: Value: 4700 пФ
C?#3 C?#6 C?#9 C?#12 = CP: as C?#3 on sheet Top; Author: Harry E. Zhurov
DA?#1-DA?#4 = MCP6004T-I/ST: AnnotateMatch: 1; Name: MCP6004T-I/ST
R?#1-R?#16 = R: as R?#1 on sheet Top
  R?#1 R?#2 R?#5 R?#6 R?#9 R?#10 R?#13 R?#14: Value: 5,1 кОм
  R?#3 R?#7 R?#11 R?#15: Value: 560 Ом
  R?#4 R?#8 R?#12 R?#16: Value: 10 кОм

## Sheet HDMI_con.SchDoc
size 311 x 223 mm
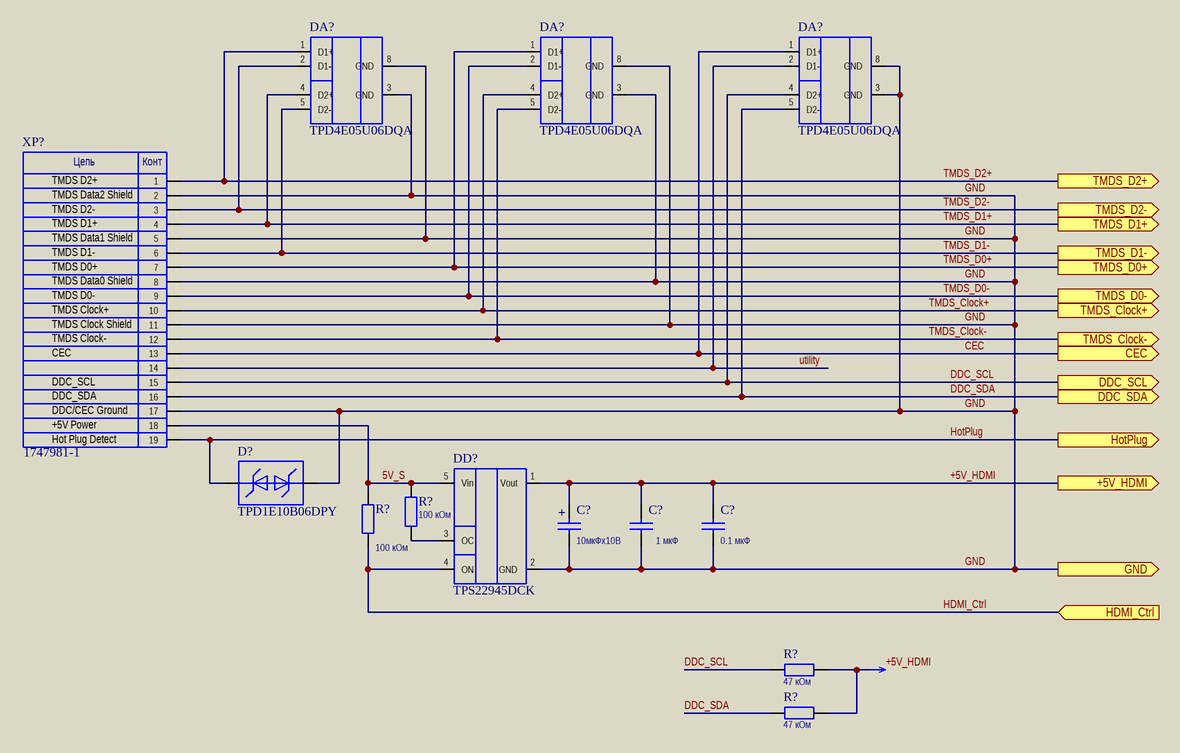
[diagram p2: HDMI_con.SchDoc]

### Parts
(Parts that share a designator on the sheet are numbered #1, #2 ... from top to bottom, then left to right.)
C?#25  value 10мкФx10В  [ChipA]  (hidden comment: CP)
C?#26  value 1 мкФ  [Chip0603]  (hidden comment: C)
C?#27  value 0.1 мкФ  [Chip0603]  (hidden comment: C)
D?#21  TPD1E10B06DPY  [X1SON]
DA?#2  TPD4E05U06DQA  [USON10]
DA?#3  TPD4E05U06DQA  [USON10]
DA?#4  TPD4E05U06DQA  [USON10]
DD?#8  TPS22945DCK  [SC-70]
R?#34  100 кОм  [Res0603]
R?#35  100 кОм  [Res0603]
R?#36  47 кОм  [Res0603]
R?#37  47 кОм  [Res0603]
XP?#6  1747981-1  [1747981-1]

### Ports
+5V_HDMI (out), CEC (out), DDC_SCL (out), DDC_SDA (out), GND (out), HDMI_Ctrl (in), HotPlug (out), TMDS_Clock+ (out), TMDS_Clock- (out), TMDS_D0+ (out), TMDS_D0- (out), TMDS_D1+ (out), TMDS_D1- (out), TMDS_D2+ (out), TMDS_D2- (out)

### Nets
GND: C?#25.2 C?#26.2 C?#27.2 D?#21.1 DA?#2.3(GND) DA?#2.8(GND) DA?#3.3(GND) DA?#3.8(GND) DA?#4.3(GND) DA?#4.8(GND) DD?#8.2(GND) XP?#6.2 XP?#6.5 XP?#6.8 XP?#6.11 XP?#6.17 ; port GND
5V_S: DD?#8.5(Vin) R?#34.2 R?#35.2 XP?#6.18
+5V_HDMI: C?#25.1 C?#26.1 C?#27.1 DD?#8.1(Vout) R?#36.1 R?#37.1 ; port +5V_HDMI
CEC: DA?#4.1(D1+) XP?#6.13 ; port CEC
DDC_SCL: DA?#4.4(D2+) R?#36.2 XP?#6.15 ; port DDC_SCL
DDC_SDA: DA?#4.5(D2-) R?#37.2 XP?#6.16 ; port DDC_SDA
HDMI_Ctrl: DD?#8.4(ON) R?#35.1 ; port HDMI_Ctrl
HotPlug: D?#21.2 XP?#6.19 ; port HotPlug
TMDS_Clock+: DA?#3.4(D2+) XP?#6.10 ; port TMDS_Clock+
TMDS_Clock-: DA?#3.5(D2-) XP?#6.12 ; port TMDS_Clock-
TMDS_D0+: DA?#3.1(D1+) XP?#6.7 ; port TMDS_D0+
TMDS_D0-: DA?#3.2(D1-) XP?#6.9 ; port TMDS_D0-
TMDS_D1+: DA?#2.4(D2+) XP?#6.4 ; port TMDS_D1+
TMDS_D1-: DA?#2.5(D2-) XP?#6.6 ; port TMDS_D1-
TMDS_D2+: DA?#2.1(D1+) XP?#6.1 ; port TMDS_D2+
TMDS_D2-: DA?#2.2(D1-) XP?#6.3 ; port TMDS_D2-
utility: DA?#4.2(D1-) XP?#6.14
NetDD?#8_3: DD?#8.3(OC) R?#34.1

Not connected (* = marked no-connect by the designer): DA?#2 6(nc) 7(nc) 9(nc) 10(nc); DA?#3 6(nc) 7(nc) 9(nc) 10(nc); DA?#4 6(nc) 7(nc) 9(nc) 10(nc)

### Notes on the sheet
- TMDS D2+
- (near XP?#6) TMDS Data2 Shield
- TMDS D2-
- TMDS D1+
- (near XP?#6) TMDS Data1 Shield
- TMDS D1-
- TMDS D0+
- (near XP?#6) TMDS Data0 Shield
- TMDS D0-
- (near XP?#6) TMDS Clock+
- (near XP?#6) TMDS Clock Shield
- (near XP?#6) TMDS Clock-
- CEC
- DDC_SCL
- DDC_SDA
- (near XP?#6) DDC/CEC Ground
- +5V Power
- (near XP?#6) Hot Plug Detect
- Перв. примен.
- М. экспертиза
- Справ. №
- Подп. и дата
- Инв. № дубл.
- Взам. инв. №
- Изм.
- Разраб.
- Лист.
- № докум.
- Подп.
- Дата
- Лит.
- Масса
- Масш.
- Инв. № подп.
- Пров.
- Т. контр.
- Н. контр.
- Утв.
- Схема электрическая
- принципиальная
- Лист
- Листов
- Копировал
- Формат А2
- (in symbol CON_19) Цепь; Конт
- (in symbol CP) +

### Library data of the parts
C?#25 = CP: as C?#3 on sheet Top; Author: Harry E. Zhurov
C?#26 C?#27 = C: as C?#1 on sheet Top; Author: Harry E. Zhurov
D?#21 = TPD1E10B06: Single-Channel ESD Protection Diode in 0402 Package; Name: TPD1E10B06DPY
DA?#2-DA?#4 = TPD4E05U06DQA: 4 Channel ESD Protection Device for Super-Speed (Up to 6 Gbps)  Interface; Name: TPD4E05U06DQA
DD?#8 = TPS22945DCKR: Name: TPS22945DCK
R?#34-R?#37 = R: as R?#1 on sheet Top
  R?#34 R?#35: Value: 100 кОм
  R?#36 R?#37: Value: 47 кОм
XP?#6 = CON_19: HDMI connector; Name: 1747981-1

## Sheet Power.SchDoc
size 437 x 311 mm; TypeSCHEM: принципиальная; DocumentNumber1: Э3
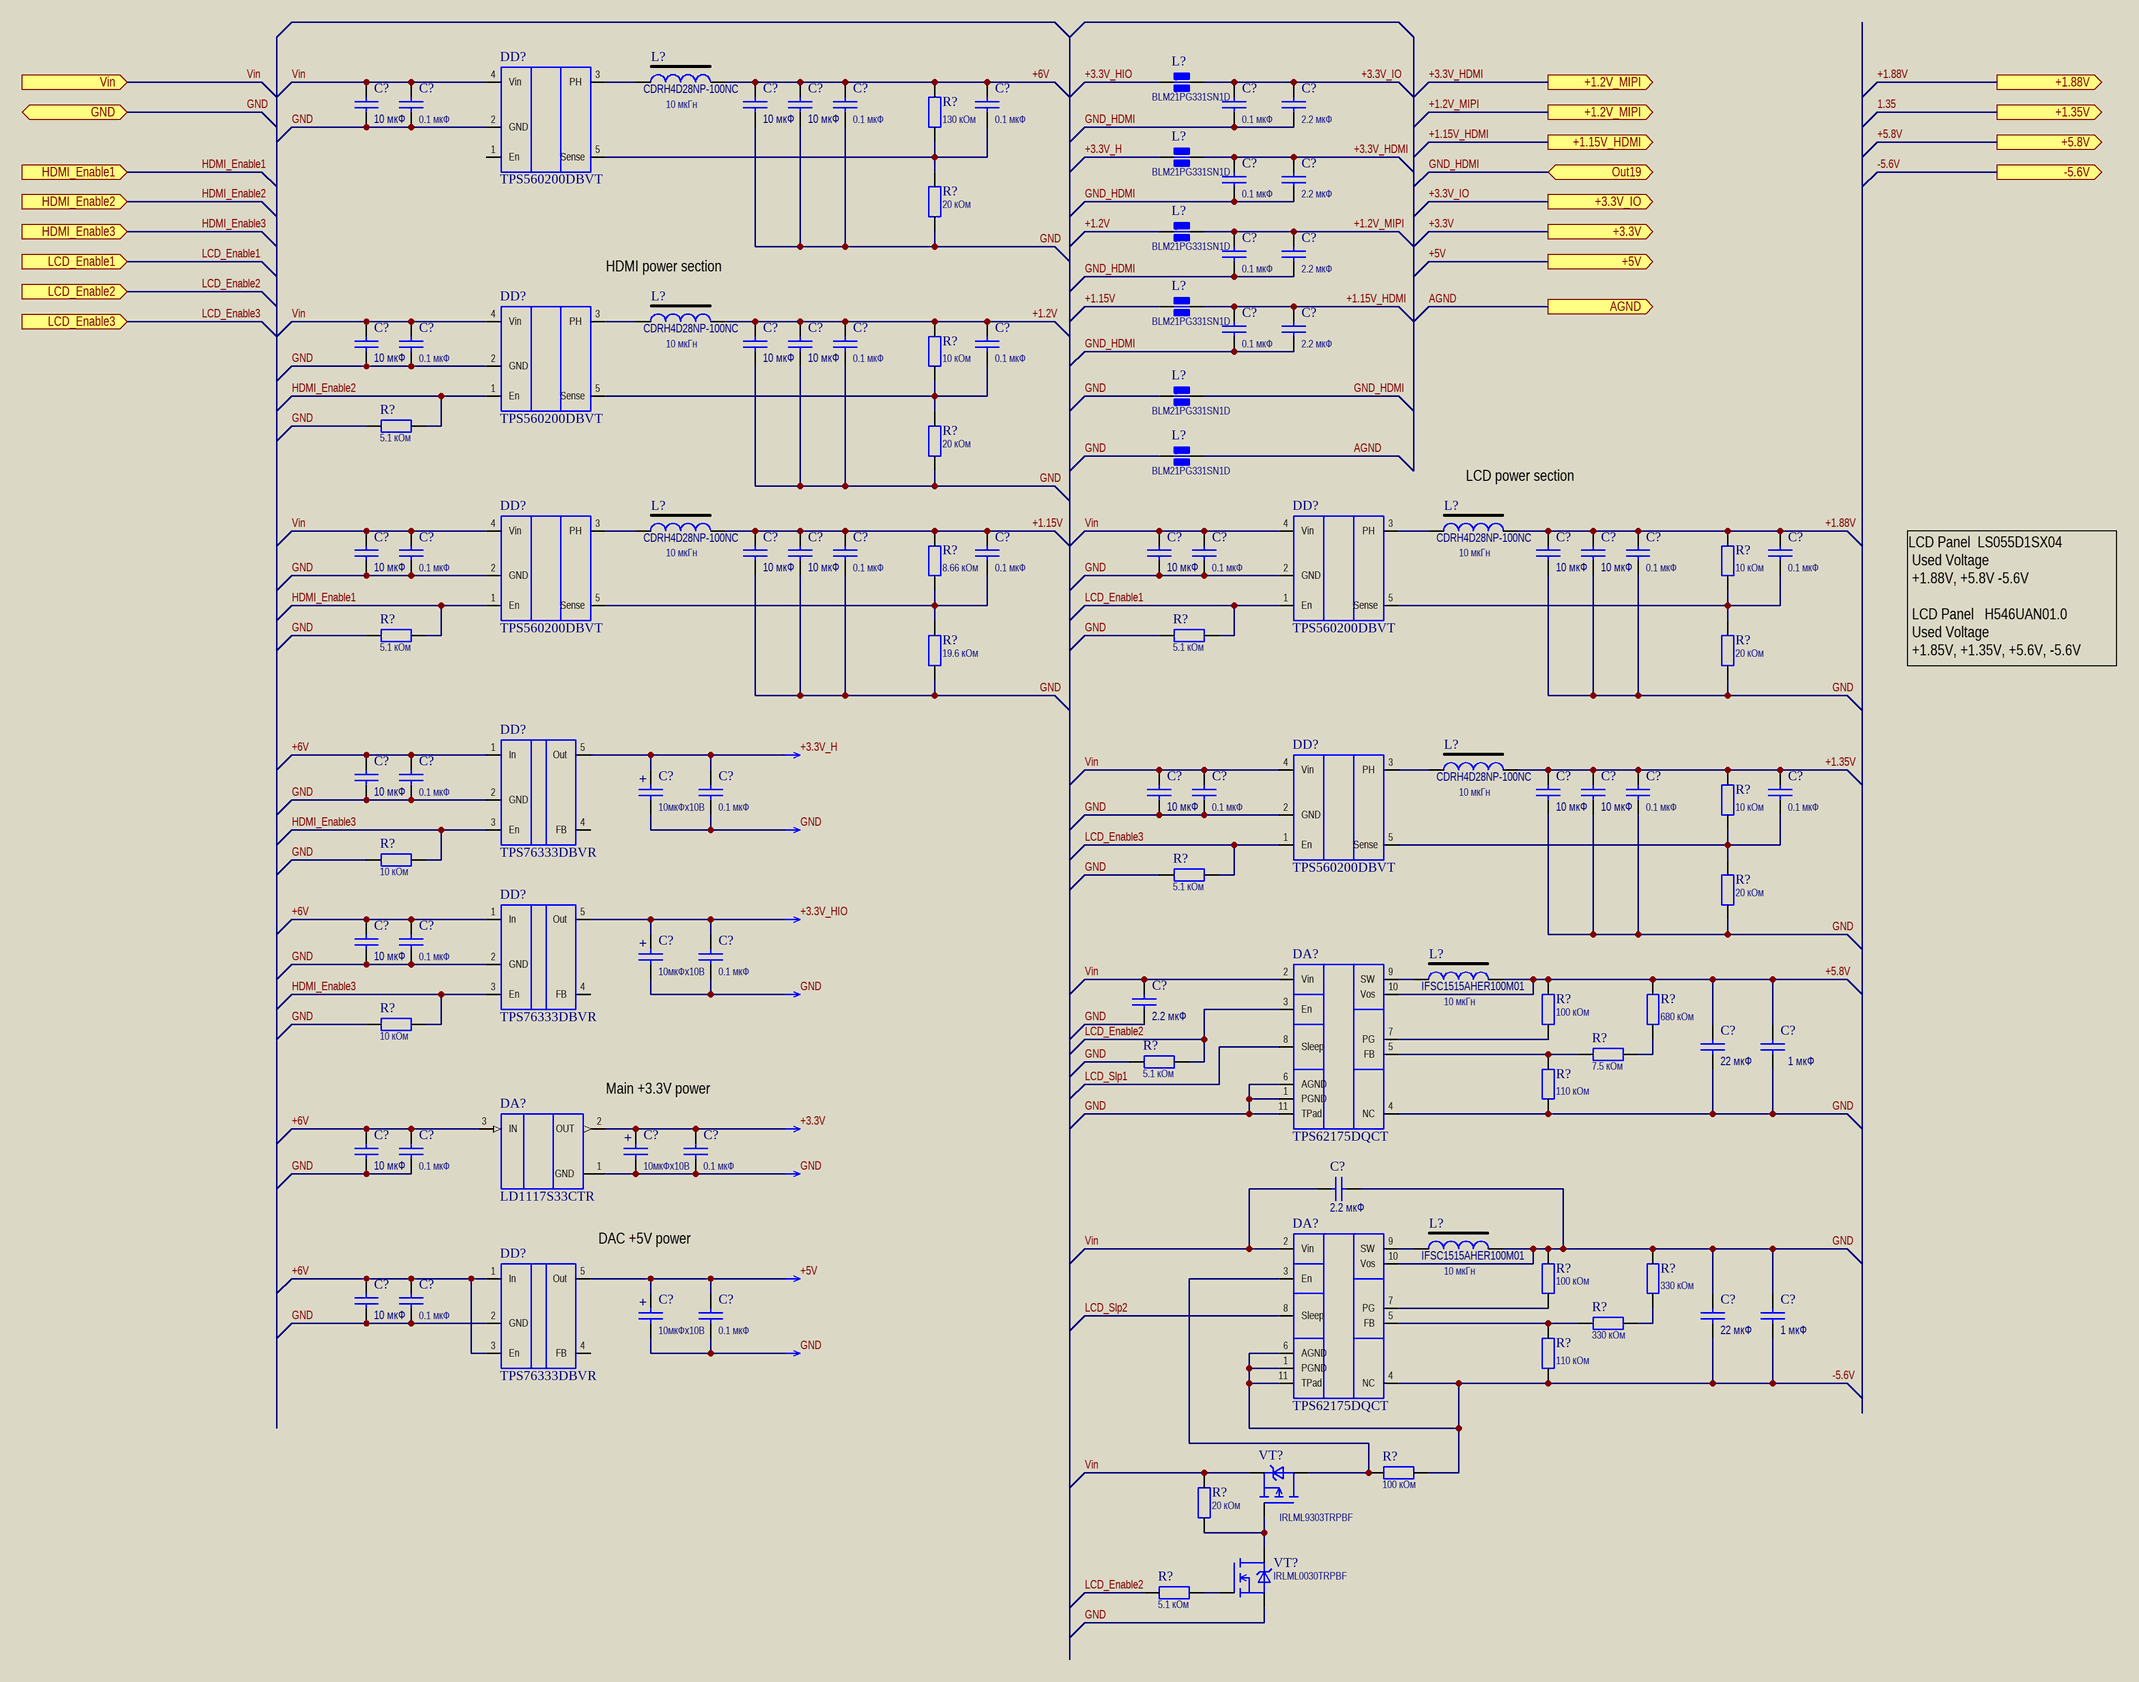
[diagram p3: Power.SchDoc]

### Parts
(Parts that share a designator on the sheet are numbered #1, #2 ... from top to bottom, then left to right.)
C?#28  10 мкФ  [Chip1210]
C?#29  value 0.1 мкФ  [Chip0603]  (hidden comment: C)
C?#30  10 мкФ  [Chip1210]
C?#31  10 мкФ  [Chip1210]
C?#32  value 0.1 мкФ  [Chip0603]  (hidden comment: C)
C?#33  value 0.1 мкФ  [Chip0603]  (hidden comment: C)
C?#34  value 0.1 мкФ  [Chip0603]  (hidden comment: C)
C?#35  value 2.2 мкФ  [Chip0603]  (hidden comment: C)
C?#36  value 0.1 мкФ  [Chip0603]  (hidden comment: C)
C?#37  value 2.2 мкФ  [Chip0603]  (hidden comment: C)
C?#38  value 0.1 мкФ  [Chip0603]  (hidden comment: C)
C?#39  value 2.2 мкФ  [Chip0603]  (hidden comment: C)
C?#40  value 0.1 мкФ  [Chip0603]  (hidden comment: C)
C?#41  value 2.2 мкФ  [Chip0603]  (hidden comment: C)
C?#42  10 мкФ  [Chip1210]
C?#43  value 0.1 мкФ  [Chip0603]  (hidden comment: C)
C?#44  10 мкФ  [Chip1210]
C?#45  10 мкФ  [Chip1210]
C?#46  value 0.1 мкФ  [Chip0603]  (hidden comment: C)
C?#47  value 0.1 мкФ  [Chip0603]  (hidden comment: C)
C?#48  10 мкФ  [Chip1210]
C?#49  value 0.1 мкФ  [Chip0603]  (hidden comment: C)
C?#50  10 мкФ  [Chip1210]
C?#51  10 мкФ  [Chip1210]
C?#52  value 0.1 мкФ  [Chip0603]  (hidden comment: C)
C?#53  value 0.1 мкФ  [Chip0603]  (hidden comment: C)
C?#54  10 мкФ  [Chip1210]
C?#55  value 0.1 мкФ  [Chip0603]  (hidden comment: C)
C?#56  10 мкФ  [Chip1210]
C?#57  10 мкФ  [Chip1210]
C?#58  value 0.1 мкФ  [Chip0603]  (hidden comment: C)
C?#59  value 0.1 мкФ  [Chip0603]  (hidden comment: C)
C?#60  10 мкФ  [Chip1210]
C?#61  value 0.1 мкФ  [Chip0603]  (hidden comment: C)
C?#62  value 10мкФx10В  [ChipA]  (hidden comment: CP)
C?#63  value 0.1 мкФ  [Chip0603]  (hidden comment: C)
C?#64  10 мкФ  [Chip1210]
C?#65  value 0.1 мкФ  [Chip0603]  (hidden comment: C)
C?#66  10 мкФ  [Chip1210]
C?#67  10 мкФ  [Chip1210]
C?#68  value 0.1 мкФ  [Chip0603]  (hidden comment: C)
C?#69  value 0.1 мкФ  [Chip0603]  (hidden comment: C)
C?#70  10 мкФ  [Chip1210]
C?#71  value 0.1 мкФ  [Chip0603]  (hidden comment: C)
C?#72  value 10мкФx10В  [ChipA]  (hidden comment: CP)
C?#73  value 0.1 мкФ  [Chip0603]  (hidden comment: C)
C?#74  2.2 мкФ  [Chip1210]
C?#75  22 мкФ  [Chip1210]
C?#76  1 мкФ  [Chip0603]
C?#77  10 мкФ  [Chip1210]
C?#78  value 0.1 мкФ  [Chip0603]  (hidden comment: C)
C?#79  value 10мкФx10В  [ChipA]  (hidden comment: CP)
C?#80  value 0.1 мкФ  [Chip0603]  (hidden comment: C)
C?#81  2.2 мкФ  [Chip1210]
C?#82  10 мкФ  [Chip1210]
C?#83  value 0.1 мкФ  [Chip0603]  (hidden comment: C)
C?#84  value 10мкФx10В  [ChipA]  (hidden comment: CP)
C?#85  value 0.1 мкФ  [Chip0603]  (hidden comment: C)
C?#86  22 мкФ  [Chip1210]
C?#87  1 мкФ  [Chip0603]
DA?#5  TPS62175DQCT  [WSON-10]
DA?#6  LD1117S33CTR  [SOT-223]
DA?#7  TPS62175DQCT  [WSON-10]
DD?#9  TPS560200DBVT  [sot23-5_s]
DD?#10  TPS560200DBVT  [sot23-5_s]
DD?#11  TPS560200DBVT  [sot23-5_s]
DD?#12  TPS560200DBVT  [sot23-5_s]
DD?#13  TPS76333DBVR  [sot23-5_s]
DD?#14  TPS560200DBVT  [sot23-5_s]
DD?#15  TPS76333DBVR  [sot23-5_s]
DD?#16  TPS76333DBVR  [sot23-5_s]
L?#3  CDRH4D28NP-100NC  value 10 мкГн  [Chip1210]
L?#4  Name: BLM21PG331SN1D  [Chip0805]  (hidden comment: Bead)
L?#5  Name: BLM21PG331SN1D  [Chip0805]  (hidden comment: Bead)
L?#6  Name: BLM21PG331SN1D  [Chip0805]  (hidden comment: Bead)
L?#7  Name: BLM21PG331SN1D  [Chip0805]  (hidden comment: Bead)
L?#8  CDRH4D28NP-100NC  value 10 мкГн  [Chip1210]
L?#9  Name: BLM21PG331SN1D  [Chip0805]  (hidden comment: Bead)
L?#10  Name: BLM21PG331SN1D  [Chip0805]  (hidden comment: Bead)
L?#11  CDRH4D28NP-100NC  value 10 мкГн  [Chip1210]
L?#12  CDRH4D28NP-100NC  value 10 мкГн  [Chip1210]
L?#13  CDRH4D28NP-100NC  value 10 мкГн  [Chip1210]
L?#14  IFSC1515AHER100M01  value 10 мкГн  [IFSC-1515AH]
L?#15  IFSC1515AHER100M01  value 10 мкГн  [IFSC-1515AH]
R?#38  130 кОм  [Res0603]
R?#39  20 кОм  [Res0603]
R?#40  10 кОм  [Res0603]
R?#41  5.1 кОм  [Res0603]
R?#42  20 кОм  [Res0603]
R?#43  8.66 кОм  [Res0603]
R?#44  10 кОм  [Res0603]
R?#45  5.1 кОм  [Res0603]
R?#46  5.1 кОм  [Res0603]
R?#47  19.6 кОм  [Res0603]
R?#48  20 кОм  [Res0603]
R?#49  10 кОм  [Res0603]
R?#50  10 кОм  [Res0603]
R?#51  5.1 кОм  [Res0603]
R?#52  20 кОм  [Res0603]
R?#53  100 кОм  [Res0603]
R?#54  680 кОм  [Res0603]
R?#55  10 кОм  [Res0603]
R?#56  7.5 кОм  [Res0603]
R?#57  5.1 кОм  [Res0603]
R?#58  110 кОм  [Res0603]
R?#59  100 кОм  [Res0603]
R?#60  330 кОм  [Res0603]
R?#61  330 кОм  [Res0603]
R?#62  110 кОм  [Res0603]
R?#63  100 кОм  [Res0603]
R?#64  20 кОм  [Res0603]
R?#65  5.1 кОм  [Res0603]
VT?#2  Name: IRLML9303TRPBF  [KT-93]  (hidden comment: MOSFET P)
VT?#3  Name: IRLML0030TRPBF  [KT-93]  (hidden comment: MOSFET N)

### Ports
+1.2V_MIPI (out), +1.15V_HDMI (out), +1.35V (out), +1.88V (out), +3.3V (out), +3.3V_IO (out), +5.8V (out), +5V (out), -5.6V (out), AGND (out), GND (bidir), HDMI_Enable1 (in), HDMI_Enable2 (in), HDMI_Enable3 (in), LCD_Enable1 (in), LCD_Enable2 (in), LCD_Enable3 (in), Out19 (bidir), Vin (in)

### Nets
+3.3V: C?#79.1 C?#80.1 DA?#6.2(OUT) DA?#6.4(Vout_tab) ; port +3.3V
+5V: C?#84.1 C?#85.1 DD?#16.5(Out) ; port +5V
GND: C?#28.2 C?#29.2 C?#30.2 C?#31.2 C?#32.2 C?#42.2 C?#43.2 C?#44.2 C?#45.2 C?#46.2 C?#48.2 C?#49.2 C?#50.2 C?#51.2 C?#52.2 C?#54.2 C?#55.2 C?#56.2 C?#57.2 C?#58.2 C?#60.2 C?#61.2 C?#62.2 C?#63.2 C?#64.2 C?#65.2 C?#66.2 C?#67.2 C?#68.2 C?#70.2 C?#71.2 C?#72.2 C?#73.2 C?#74.2 C?#75.2 C?#76.2 C?#77.2 C?#78.2 C?#79.2 C?#80.2 C?#81.2 C?#82.2 C?#83.2 C?#84.2 C?#85.2 C?#86.1 C?#87.1 DA?#5.1(PGND) DA?#5.4(NC) DA?#5.6(AGND) DA?#5.11(TPad) DA?#6.1(GND) DA?#7.10(Vos) DD?#9.2(GND) DD?#10.2(GND) DD?#11.2(GND) DD?#12.2(GND) DD?#13.2(GND) DD?#14.2(GND) DD?#15.2(GND) DD?#16.2(GND) L?#9.1 L?#10.1 L?#15.2 R?#39.1 R?#41.2 R?#42.1 R?#45.2 R?#46.2 R?#47.1 R?#48.1 R?#50.2 R?#51.2 R?#52.1 R?#55.2 R?#57.1 R?#58.1 R?#59.1 R?#60.2 VT?#3.2(SOURCE) ; port GND
1.35: port +1.35V
+1.2V: C?#44.1 C?#45.1 C?#46.1 C?#47.1 L?#6.1 L?#8.2 R?#40.2
+1.2V_MIPI: C?#36.1 C?#37.1 C?#38.1 C?#39.1 L?#5.2 L?#6.2 ; port +1.2V_MIPI  [also labelled +3.3V_HDMI]
+1.15V: C?#50.1 C?#51.1 C?#52.1 C?#53.1 L?#7.1 L?#11.2 R?#43.2
+1.15V_HDMI: C?#40.1 C?#41.1 L?#7.2 ; port +1.15V_HDMI
+1.35V: C?#66.1 C?#67.1 C?#68.1 C?#69.1 L?#13.2 R?#49.2
+1.88V: C?#56.1 C?#57.1 C?#58.1 C?#59.1 L?#12.2 R?#44.2 ; port +1.88V
+3.3V_H: C?#62.1 C?#63.1 DD?#13.5(Out) L?#5.1
+3.3V_HIO: C?#72.1 C?#73.1 DD?#15.5(Out) L?#4.1
+3.3V_IO: C?#34.1 C?#35.1 L?#4.2 ; port +3.3V_IO
+5.8V: C?#75.1 C?#76.1 DA?#5.10(Vos) L?#14.2 R?#53.1 R?#54.2 ; port +5.8V
+6V: C?#30.1 C?#31.1 C?#32.1 C?#33.1 C?#60.1 C?#61.1 C?#70.1 C?#71.1 C?#77.1 C?#78.1 C?#82.1 C?#83.1 DA?#6.3(IN) DD?#13.1(In) DD?#15.1(In) DD?#16.1(In) DD?#16.3(En) L?#3.2 R?#38.2
-5.6V: C?#86.2 C?#87.2 DA?#7.1(PGND) DA?#7.4(NC) DA?#7.6(AGND) DA?#7.11(TPad) R?#62.1 R?#63.1 ; port -5.6V
AGND: L?#10.2 ; port AGND
GND_HDMI: C?#34.2 C?#35.2 C?#36.2 C?#37.2 C?#38.2 C?#39.2 C?#40.2 C?#41.2 L?#9.2 ; port Out19
HDMI_Enable1: DD?#11.1(En) R?#45.1 ; port HDMI_Enable1
HDMI_Enable2: DD?#10.1(En) R?#41.1 ; port HDMI_Enable2
HDMI_Enable3: DD?#13.3(En) DD?#15.3(En) R?#50.1 R?#55.1 ; port HDMI_Enable3
LCD_Enable1: DD?#12.1(En) R?#46.1 ; port LCD_Enable1
LCD_Enable2: DA?#5.3(En) R?#57.2 R?#65.2 ; port LCD_Enable2
LCD_Enable3: DD?#14.1(En) R?#51.1 ; port LCD_Enable3
LCD_Slp1: DA?#5.8(Sleep)
LCD_Slp2: DA?#7.8(Sleep)
Vin: C?#28.1 C?#29.1 C?#42.1 C?#43.1 C?#48.1 C?#49.1 C?#54.1 C?#55.1 C?#64.1 C?#65.1 C?#74.1 C?#81.1 DA?#5.2(Vin) DA?#7.2(Vin) DD?#9.4(Vin) DD?#10.4(Vin) DD?#11.4(Vin) DD?#12.4(Vin) DD?#14.4(Vin) R?#64.2 VT?#2.2(SOURCE) ; port Vin
NetC?#33_2: C?#33.2 DD?#9.5(Sense) R?#38.1 R?#39.2
NetC?#47_2: C?#47.2 DD?#10.5(Sense) R?#40.1 R?#42.2
NetC?#53_2: C?#53.2 DD?#11.5(Sense) R?#43.1 R?#47.2
NetC?#59_2: C?#59.2 DD?#12.5(Sense) R?#44.1 R?#48.2
NetC?#69_2: C?#69.2 DD?#14.5(Sense) R?#49.1 R?#52.2
NetDA?#5_5: DA?#5.5(FB) R?#56.2 R?#58.2
NetDA?#5_7: DA?#5.7(PG) R?#53.2
NetDA?#5_9: DA?#5.9(SW) L?#14.1
NetDA?#7_3: DA?#7.3(En) R?#63.2 VT?#2.1(DRAIN)
NetDA?#7_5: DA?#7.5(FB) R?#61.2 R?#62.2
NetDA?#7_7: DA?#7.7(PG) R?#59.2
NetDA?#7_9: DA?#7.9(SW) L?#15.1
NetDD?#9_3: DD?#9.3(PH) L?#3.1
NetDD?#10_3: DD?#10.3(PH) L?#8.1
NetDD?#11_3: DD?#11.3(PH) L?#11.1
NetDD?#12_3: DD?#12.3(PH) L?#12.1
NetDD?#14_3: DD?#14.3(PH) L?#13.1
NetR?#54_1: R?#54.1 R?#56.1
NetR?#60_1: R?#60.1 R?#61.1
NetR?#64_1: R?#64.1 VT?#2.3(GATE) VT?#3.1(DRAIN)
NetR?#65_1: R?#65.1 VT?#3.3(GATE)

Not connected (* = marked no-connect by the designer): DD?#9 1(En); DD?#13 4(FB); DD?#15 4(FB); DD?#16 4(FB)

### Notes on the sheet
- HDMI power section
- LCD power section
- LCD Panel  LS055D1SX04
  Used Voltage
  +1.88V, +5.8V -5.6V
  LCD Panel   H546UAN01.0
  Used Voltage
  +1.85V, +1.35V, +5.6V, -5.6V
- Main +3.3V power
- DAC +5V power
- Перв. примен.
- М. экспертиза
- Справ. №
- Подп. и дата
- Инв. № дубл.
- Взам. инв. №
- Изм.
- Разраб.
- Лист.
- № докум.
- Подп.
- Дата
- Лит.
- Масса
- Масш.
- Инв. № подп.
- Пров.
- Т. контр.
- Н. контр.
- Утв.
- Схема электрическая
- принципиальная
- Лист
- Листов
- Копировал
- Формат А1
- (in symbol CP) +

### Library data of the parts
C?#28 C?#30 C?#31 C?#42 C?#44 C?#45 C?#48 C?#50 C?#51 C?#54 C?#56 C?#57 C?#60 C?#64 C?#66 C?#67 C?#70 C?#74 C?#77 C?#81 C?#82 = C: Manufacturer: Any; SubClass: General Purpose; Class: Capacitors; Name: GRM32DR61E106KA12L; Author: Harry E. Zhurov
  C?#28 C?#30 C?#31 C?#42 C?#44 C?#45 C?#48 C?#50 C?#51 C?#54 C?#56 C?#57 C?#60 C?#64 C?#66 C?#67 C?#70 C?#77 C?#82: Value: 10 мкФ
  C?#74 C?#81: Value: 2.2 мкФ
C?#29 C?#32-C?#41 C?#43 C?#46 C?#47 C?#49 C?#52 C?#53 C?#55 C?#58 C?#59 C?#61 C?#63 C?#65 C?#68 C?#69 C?#71 C?#73 C?#78 C?#80 C?#83 C?#85 = C: as C?#1 on sheet Top; Author: Harry E. Zhurov
C?#62 C?#72 C?#79 C?#84 = CP: as C?#3 on sheet Top; Author: Harry E. Zhurov
C?#75 C?#86 = C: Manufacturer: Any; SubClass: General Purpose; Class: Capacitors; Name: CC1206KKX5R6BB226; Author: Harry E. Zhurov; Value: 22 мкФ
C?#76 C?#87 = C: Manufacturer: Any; SubClass: General Purpose; Class: Capacitors; Name: CC0603KRX5R6BB105; Author: Harry E. Zhurov; Value: 1 мкФ
DA?#5 DA?#7 = TPS62175: 28-V, 0.5-A Step-Down Converter With Sleep Mode; Name: TPS62175DQCT
DA?#6 = REG1117: LDO; Name: LD1117S33CTR
DD?#9-DD?#12 DD?#14 = TPS560200DBVT: 4.5V to 17V Input, 500mA Synchronous Step Down SWIFT Converter  with Advanced Eco-mode; Name: TPS560200DBVT
L?#3 L?#8 L?#11-L?#13 = INDUCTANCE CORE: Manufacturer: Sumida; SubClass: With Core; Class: Inductance; Author: Harry E. Zhurov; Name: CDRH4D28NP-100NC
L?#4-L?#7 L?#9 L?#10 = Bead: as L?#1 on sheet Top; Author: Harry E. Zhurov
L?#14 L?#15 = INDUCTANCE CORE: Manufacturer: Vishay; SubClass: With Core; Class: Inductance; Author: Harry E. Zhurov; Name: IFSC1515AHER100M01
R?#38-R?#52 R?#55 R?#57 R?#63-R?#65 = R: as R?#1 on sheet Top
  R?#38: Value: 130 кОм
  R?#39 R?#42 R?#48 R?#52 R?#64: Value: 20 кОм
  R?#40 R?#44 R?#49 R?#50 R?#55: Value: 10 кОм
  R?#41 R?#45 R?#46 R?#51 R?#57 R?#65: Value: 5.1 кОм
  R?#43: Value: 8.66 кОм
  R?#47: Value: 19.6 кОм
  R?#63: Value: 100 кОм
R?#53 R?#59 = R: Manufacturer: Any; Class: Resistor; SubClass: Constant; Name: RC0603FR-07100KL; Value: 100 кОм
R?#54 = R: Manufacturer: Any; Class: Resistor; SubClass: Constant; Name: RC0603FR-07680KL; Value: 680 кОм
R?#56 = R: Manufacturer: Any; Class: Resistor; SubClass: Constant; Name: RC0603FR-077K5L; Value: 7.5 кОм
R?#58 R?#62 = R: Manufacturer: Any; Class: Resistor; SubClass: Constant; Name: RC0603FR-07110KL; Value: 110 кОм
R?#60 R?#61 = R: Manufacturer: Any; Class: Resistor; SubClass: Constant; Name: RC0603JR-07330KL; Value: 330 кОм
VT?#2 = MOSFET P: Manufacturer: Ангстрем; Class: Transistors; SubClass: P-MOSFET; Author: Harry E. Zhurov
VT?#3 = MOSFET N: Manufacturer: ВЗЗП-С; Class: Transistors; SubClass: N-MOSFET; Author: Harry E. Zhurov
DD?#13 DD?#15 DD?#16 = TPS76333DBVR: Name: TPS76333DBVR

## Sheet LedDRV.SchDoc
size 311 x 223 mm
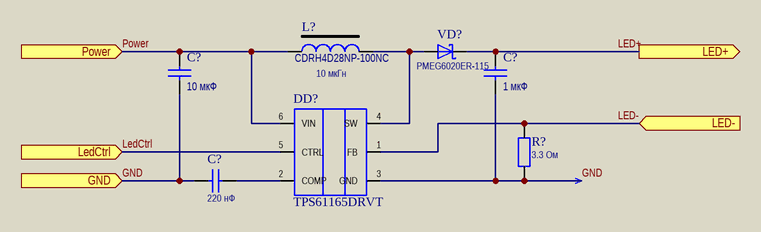
[diagram p4: LedDRV.SchDoc]

### Parts
(Parts that share a designator on the sheet are numbered #1, #2 ... from top to bottom, then left to right.)
C?#88  10 мкФ  [Chip1210]
C?#89  1 мкФ  [Chip1210]
C?#90  value 220 нФ  [Chip0603]  (hidden comment: C)
DD?#17  TPS61165DRVT  [WSON6]
L?#16  CDRH4D28NP-100NC  value 10 мкГн  [Chip1210]
R?#66  3.3 Ом  [Res0603]
VD?#5  Name: PMEG6020ER-115  [chip2218]  (hidden comment: SHOTTKY_DIODE)

### Ports
GND (in), LED+ (out), LED- (in), LedCtrl (in), Power (in)

### Nets
GND: C?#88.2 C?#89.2 C?#90.1 DD?#17.3(GND) DD?#17.7(TPad) R?#66.2 ; port GND
Power: C?#88.1 DD?#17.6(VIN) L?#16.1 ; port Power  [project net +5V]
LED+: C?#89.1 VD?#5.1 ; port LED+  [project net LCD_LED+]
LED-: DD?#17.1(FB) R?#66.1 ; port LED-  [project net LCD_LED-]
LedCtrl: DD?#17.5(CTRL) ; port LedCtrl
NetC?#90_2: C?#90.2 DD?#17.2(COMP)
NetDD?#17_4: DD?#17.4(SW) L?#16.2 VD?#5.2

### Notes on the sheet
- Перв. примен.
- М. экспертиза
- Справ. №
- Подп. и дата
- Инв. № дубл.
- Взам. инв. №
- Изм.
- Разраб.
- Лист.
- № докум.
- Подп.
- Дата
- Лит.
- Масса
- Масш.
- Инв. № подп.
- Пров.
- Т. контр.
- Н. контр.
- Утв.
- Схема электрическая
- принципиальная
- Лист
- Листов
- Копировал
- Формат А2

### Library data of the parts
C?#88 = C: as C?#28 on sheet Power; Author: Harry E. Zhurov; Value: 10 мкФ
C?#89 = C: Manufacturer: Any; SubClass: General Purpose; Class: Capacitors; Name: CC0603KRX5R8BB105; Author: Harry E. Zhurov; Value: 1 мкФ
C?#90 = C: Manufacturer: Any; SubClass: General Purpose; Class: Capacitors; Name: GRM188R71E224KA88D; Author: Harry E. Zhurov
DD?#17 = TPS61165DRVT: High Brightness White LED Driver in 2mm x 2mm  QFN and SOT-23 Packages; Name: TPS61165DRVT
L?#16 = INDUCTANCE CORE: as L?#3 on sheet Power; Class: Inductance; Author: Harry E. Zhurov; Name: CDRH4D28NP-100NC
R?#66 = R: Manufacturer: Any; Class: Resistor; SubClass: Constant; Name: RC0603FR-073R3L; Value: 3.3 Ом
VD?#5 = SHOTTKY_DIODE: Manufacturer: ВЗПП-С; Class: Diodes; SubClass: Shottky

## Sheet LCD_Connector.SchDoc
size 311 x 223 mm
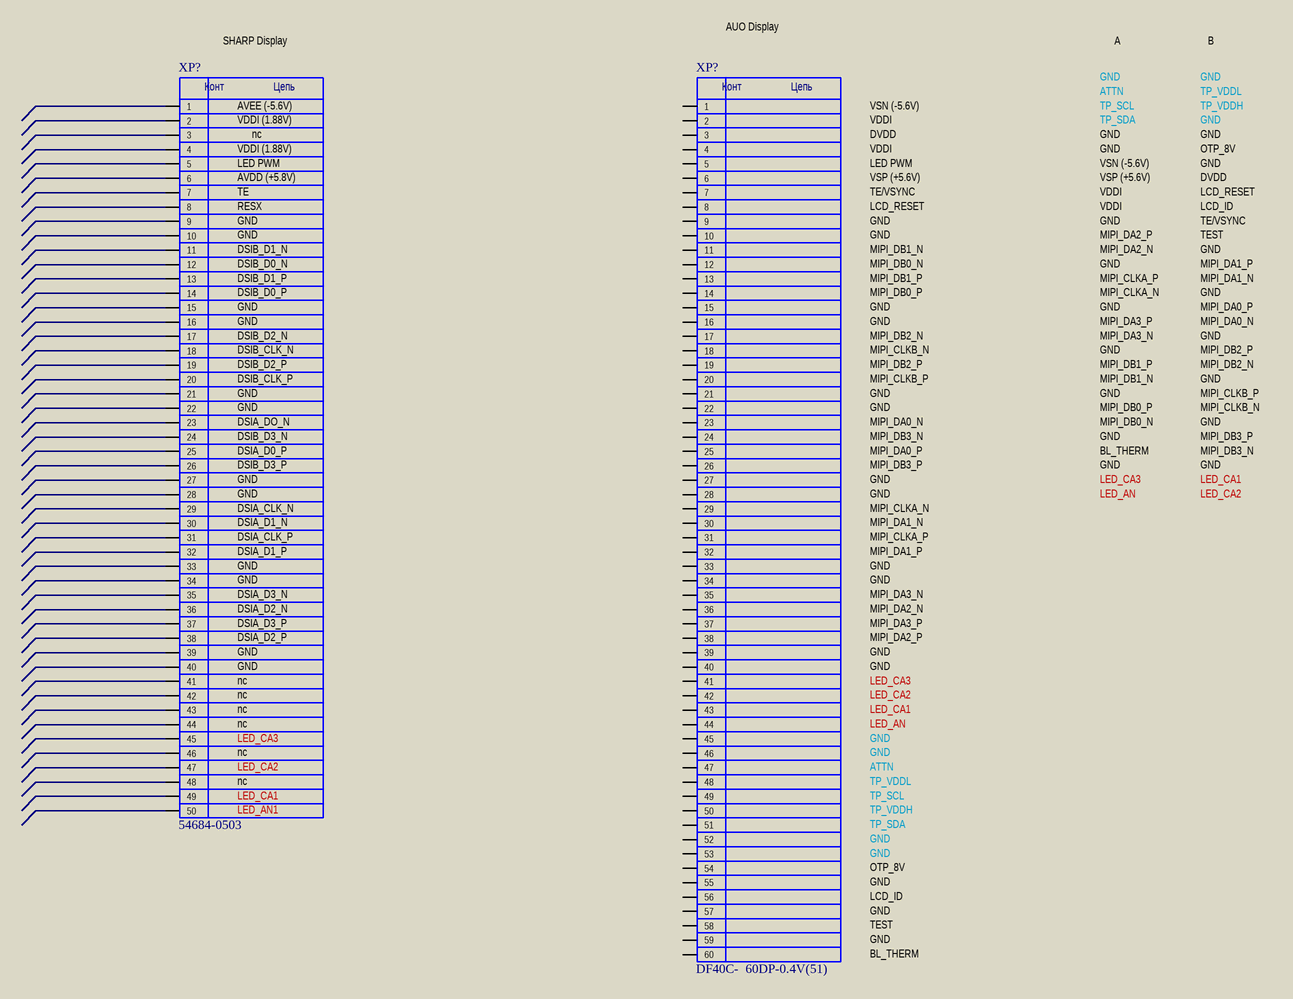
[diagram p5: LCD_Connector.SchDoc]

### Parts
(Parts that share a designator on the sheet are numbered #1, #2 ... from top to bottom, then left to right.)
XP?#7  CON_50  [54684-0503]  (value not drawn)
XP?#8  CON_60  [DF40C-  60DP-0.4V(51)]  (value not drawn)

### Nets

Not connected (* = marked no-connect by the designer): XP?#7 1 2 3 4 5 6 7 8 9 10 11 12 13 14 15 16 17 18 19 20 21 22 23 24 25 26 27 28 29 30 31 32 33 34 35 36 37 38 39 40 41 42 43 44 45 46 47 48 49 50; XP?#8 1 2 3 4 5 6 7 8 9 10 11 12 13 14 15 16 17 18 19 20 21 22 23 24 25 26 27 28 29 30 31 32 33 34 35 36 37 38 39 40 41 42 43 44 45 46 47 48 49 50 51 52 53 54 55 56 57 58 59 60

### Notes on the sheet
- SHARP Display
- AUO Display
- GND
- A
- B
- AVEE (-5.6V)
- VDDI (1.88V)
- LED PWM
- nc
- VSN (-5.6V)
- VDDI
- DVDD
- ATTN
- TP_SCL
- TP_SDA
- TP_VDDL
- TP_VDDH
- OTP_8V
- AVDD (+5.8V)
- TE
- RESX
- VSP (+5.6V)
- LCD_RESET
- TE/VSYNC
- LCD_ID
- DSIB_D1_N
- DSIB_D0_N
- DSIB_D1_P
- DSIB_D0_P
- MIPI_DB1_P
- MIPI_DB1_N
- MIPI_DB0_P
- MIPI_DB0_N
- MIPI_DA2_P
- MIPI_DA2_N
- MIPI_CLKA_P
- MIPI_CLKA_N
- TEST
- MIPI_DA1_P
- MIPI_DA1_N
- MIPI_DA0_P
- DSIB_D2_N
- DSIB_CLK_N
- DSIB_D2_P
- MIPI_DB2_P
- MIPI_DB2_N
- MIPI_CLKB_N
- MIPI_DA3_P
- MIPI_DA3_N
- MIPI_DA0_N
- DSIB_CLK_P
- DSIA_DO_N
- DSIB_D3_N
- DSIA_D0_P
- MIPI_CLKB_P
- MIPI_DB3_N
- BL_THERM
- MIPI_DB3_P
- DSIB_D3_P
- DSIA_CLK_N
- LED_CA3
- LED_AN
- LED_CA1
- LED_CA2
- DSIA_D1_N
- DSIA_CLK_P
- DSIA_D1_P
- DSIA_D3_N
- DSIA_D2_N
- DSIA_D3_P
- DSIA_D2_P
- LED_AN1
- Перв. примен.
- М. экспертиза
- Справ. №
- Подп. и дата
- Инв. № дубл.
- Взам. инв. №
- Изм.
- Разраб.
- Лист.
- № докум.
- Подп.
- Дата
- Лит.
- Масса
- Масш.
- Инв. № подп.
- Пров.
- Т. контр.
- Н. контр.
- Утв.
- Схема электрическая
- принципиальная
- Лист
- Листов
- Копировал
- Формат А2
- (in symbol CON_50) Конт; Цепь
- (in symbol CON_60) Конт; Цепь

### Library data of the parts
XP?#7 = CON_50: SlimStack 0.40mm Pitch Board-to-Board Connectors; Name: 54684-0503
XP?#8 = CON_60: Name: DF40C-  60DP-0.4V(51)

## Nets that join several sheets
+3.3V: Top (23 pins), Power (C?#79.1 C?#80.1 DA?#6.2 DA?#6.4)
+5V: Top (C?#9.1 DA?#1.5 L?#1.1), A2 (C?_A2#13.1 C?_A2#14.1 DA?_A2#1.4), A3 (C?_A3#13.1 C?_A3#14.1 DA?_A3#1.4), Power (C?#84.1 C?#85.1 DD?#16.5), LedDRV (C?#88.1 DD?#17.6 L?#16.1)
GND: Top (33 pins), HDMI_con (16 pins), Power (80 pins), LedDRV (6 pins)
GNDA: Top (5 pins), A2 (11 pins), A3 (11 pins)
+1.2V_MIPI: Top (DD?#4.B10 DD?#4.J10), Power (6 pins)
+1.15V_HDMI: Top (DD?#4.B2 DD?#4.C10 DD?#4.G2 DD?#4.K6), Power (C?#40.1 C?#41.1 L?#7.2)
+3.3V_IO: Top (5 pins), Power (C?#34.1 C?#35.1 L?#4.2)
+5V_HDMI: Top (DD?#2.A4 R?#6.1), HDMI_con (6 pins)
AGND: Top (9 pins), Power (L?#10.2)
CEC: Top (DD?#2.A2), HDMI_con (DA?#4.1 XP?#6.13)
DDC_SCL: Top (DD?#2.A3), HDMI_con (DA?#4.4 R?#36.2 XP?#6.15)
DDC_SDA: Top (DD?#2.B3), HDMI_con (DA?#4.5 R?#37.2 XP?#6.16)
HDMI_Ctrl: Top (DD?#3.37), HDMI_con (DD?#8.4 R?#35.1)
HDMI_Enable1: Top (DD?#3.8), Power (DD?#11.1 R?#45.1)
HDMI_Enable2: Top (DD?#3.9), Power (DD?#10.1 R?#41.1)
HDMI_Enable3: Top (DD?#3.10), Power (DD?#13.3 DD?#15.3 R?#50.1 R?#55.1)
HotPlug: Top (R?#11.2), HDMI_con (D?#21.2 XP?#6.19)
In1: Top (DD?#1.20), A3 (R?_A3#2.2)
In1: Top (DD?#1.27), A2 (R?_A2#2.2)
In2: Top (DD?#1.19), A3 (R?_A3#6.2)
In2: Top (DD?#1.26), A2 (R?_A2#6.2)
In3: Top (DD?#1.16), A3 (R?_A3#10.2)
In3: Top (DD?#1.22), A2 (R?_A2#10.2)
In4: Top (DD?#1.15), A3 (R?_A3#14.2)
In4: Top (DD?#1.21), A2 (R?_A2#14.2)
LCD_Enable1: Top (DD?#3.11), Power (DD?#12.1 R?#46.1)
LCD_Enable2: Top (DD?#3.24), Power (DA?#5.3 R?#57.2 R?#65.2)
LCD_Enable3: Top (DD?#3.25), Power (DD?#14.1 R?#51.1)
LedCtrl: Top (DD?#3.41), LedDRV (DD?#17.5)
Out1: Top (XP?#1.3), A2 (C?_A2#3.2 R?_A2#4.1)
Out1: Top (XP?#4.5), A3 (C?_A3#3.2 R?_A3#4.1)
Out2: Top (XP?#1.2), A2 (C?_A2#6.2 R?_A2#8.1)
Out2: Top (XP?#4.6), A3 (C?_A3#6.2 R?_A3#8.1)
Out3: Top (XP?#4.1), A2 (C?_A2#9.2 R?_A2#12.1)
Out3: Top (XP?#4.9), A3 (C?_A3#9.2 R?_A3#12.1)
Out4: Top (XP?#4.2), A2 (C?_A2#12.2 R?_A2#16.1)
Out4: Top (XP?#4.10), A3 (C?_A3#12.2 R?_A3#16.1)
TMDS_Clock+: Top (DD?#2.C1), HDMI_con (DA?#3.4 XP?#6.10)
TMDS_Clock-: Top (DD?#2.C2), HDMI_con (DA?#3.5 XP?#6.12)
TMDS_D0+: Top (DD?#2.D1), HDMI_con (DA?#3.1 XP?#6.7)
TMDS_D0-: Top (DD?#2.D2), HDMI_con (DA?#3.2 XP?#6.9)
TMDS_D1+: Top (DD?#2.E1), HDMI_con (DA?#2.4 XP?#6.4)
TMDS_D1-: Top (DD?#2.E2), HDMI_con (DA?#2.5 XP?#6.6)
TMDS_D2+: Top (DD?#2.F1), HDMI_con (DA?#2.1 XP?#6.1)
TMDS_D2-: Top (DD?#2.F2), HDMI_con (DA?#2.2 XP?#6.3)
Vcom: Top (DA?#1.1 DA?#1.4), A2 (DA?_A2#1.3 DA?_A2#2.5 DA?_A2#3.10 DA?_A2#4.12), A3 (DA?_A3#1.3 DA?_A3#2.5 DA?_A3#3.10 DA?_A3#4.12)
Vin: Top (VD?#1.1 VD?#1.2 XP?#2.3), Power (21 pins)